# EAGLE design mikeboard (EAGLE 5.11)

## Sheet 1 of 6
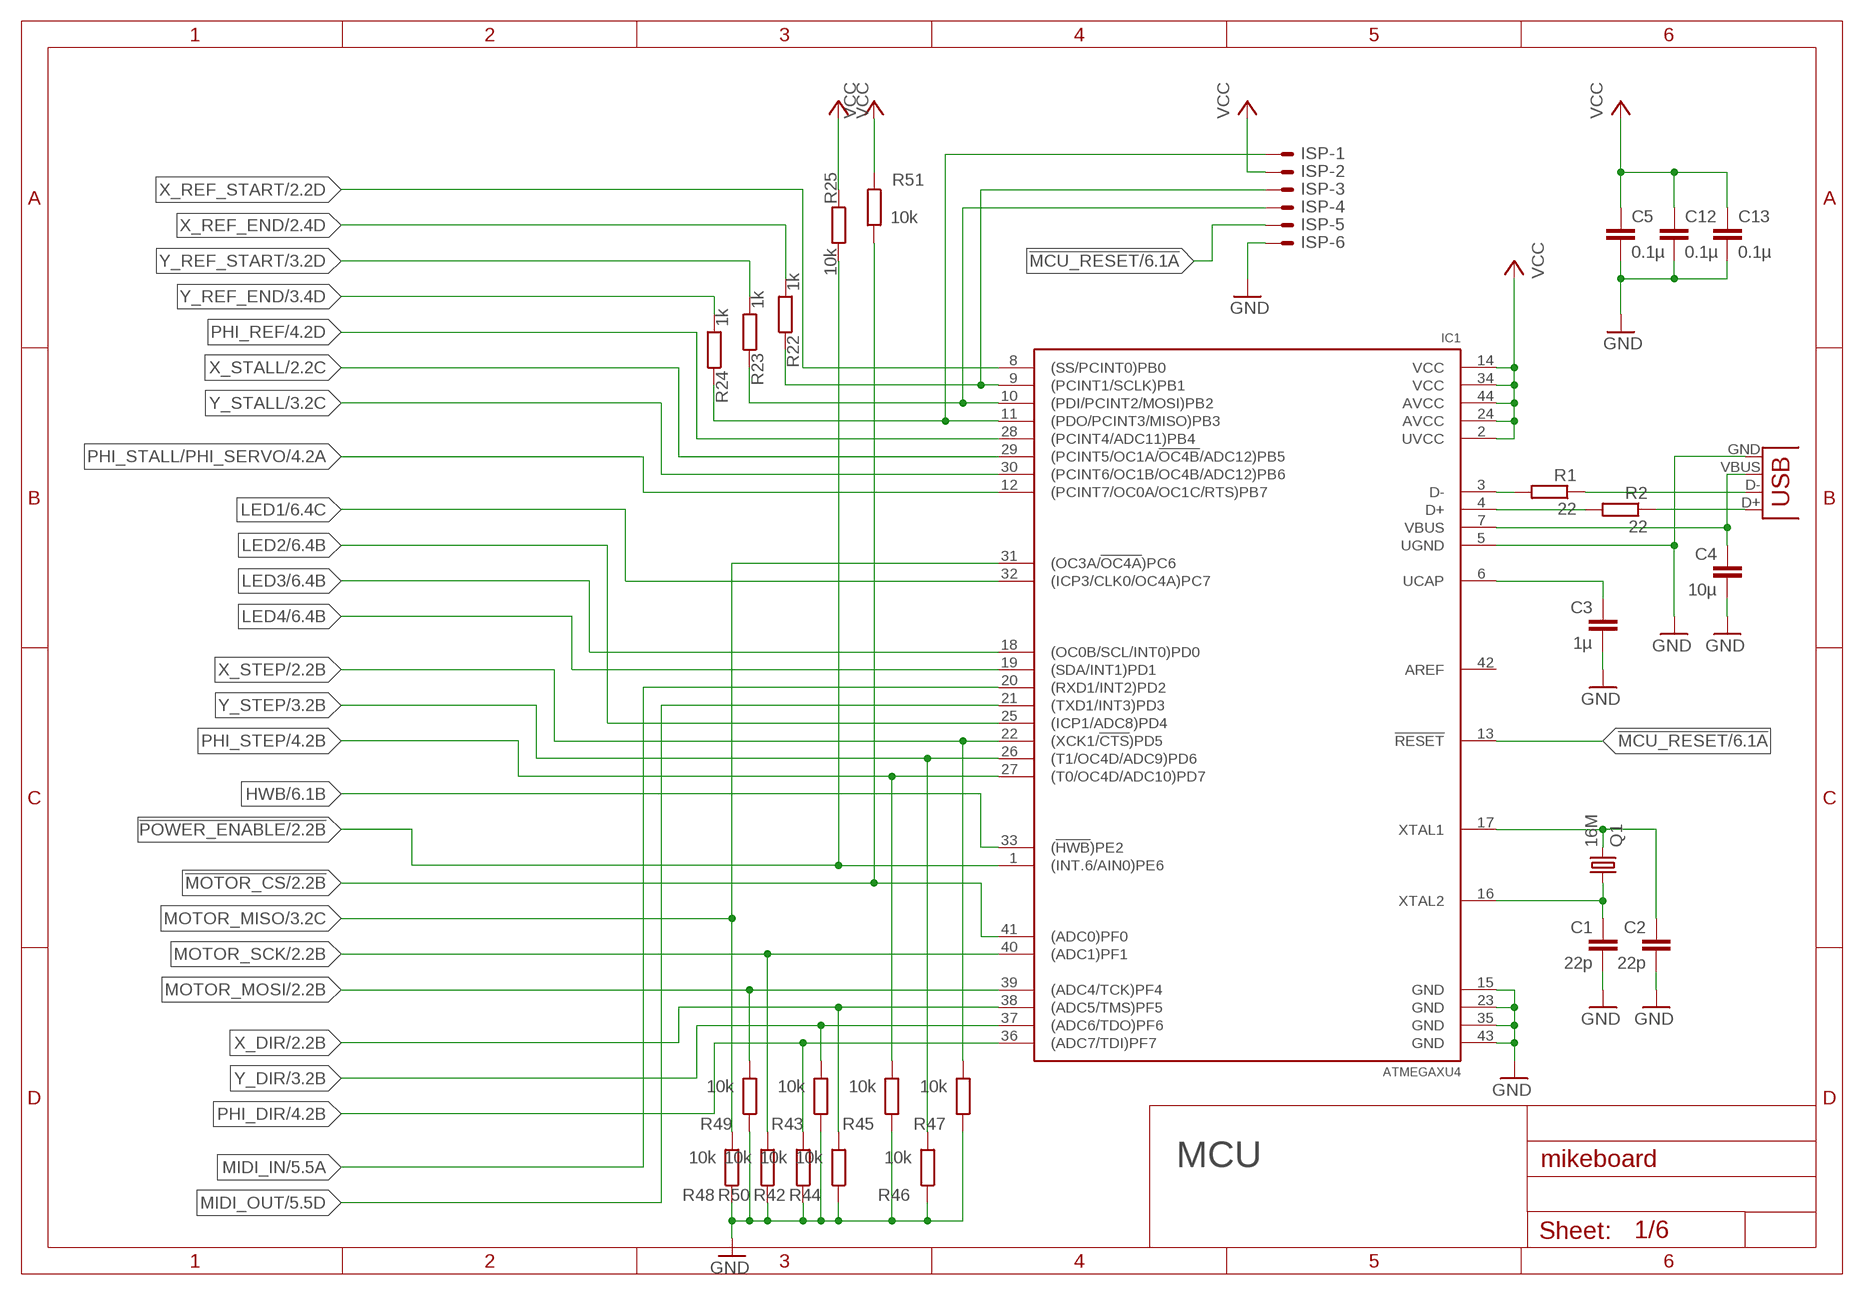
[diagram p0: schematic, sheet 1]

### Parts
C1  22p  C-EUC0603K  [C0603K]
C2  22p  C-EUC0603K  [C0603K]
C3  1µ  C-EUC0603K  [C0603K]
C4  10µ  C-EUC1206K  [C1206K]
C5  0.1µ  C-EUC0603K  [C0603K]
C12  0.1µ  C-EUC0603K  [C0603K]
C13  0.1µ  C-EUC0603K  [C0603K]
IC1  ATMEGAXU4  [TQFP44]
ISP  ML6E  [ML6]
Q1  16M  CRYSTALHC49S  [HC49/S]
R1  22  R-EU_R0603  [R0603]
R2  22  R-EU_R0603  [R0603]
R22  1k  R-EU_R0603  [R0603]
R23  1k  R-EU_R0603  [R0603]
R24  1k  R-EU_R0603  [R0603]
R25  10k  R-EU_R0603  [R0603]
R42  10k  R-EU_R0603  [R0603]
R43  10k  R-EU_R0603  [R0603]
R44  10k  R-EU_R0603  [R0603]
R45  10k  R-EU_R0603  [R0603]
R46  10k  R-EU_R0603  [R0603]
R47  10k  R-EU_R0603  [R0603]
R48  10k  R-EU_R0603  [R0603]
R49  10k  R-EU_R0603  [R0603]
R50  10k  R-EU_R0603  [R0603]
R51  10k  R-EU_R0603  [R0603]
USB  USBPTH  [USB-B-PTH]

### Nets
!MCU_RESET: IC1.13(!RESET) ISP.5 ; also sheet 6
!MOTOR_CS: IC1.41((ADC0)PF0) R51.2 ; also sheet 2,3,4
!POWER_ENABLE: IC1.1((INT.6/AIN0)PE6) R25.2 ; also sheet 2,3,4
GND: C1.2 C2.2 C3.2 C4.2 C5.2 C12.2 C13.2 IC1.5(UGND) IC1.15(GND) IC1.23(GND) IC1.35(GND) IC1.43(GND) ISP.6 R42.1 R43.1 R44.1 R45.1 R46.1 R47.1 R48.1 R49.1 R50.1 USB.GND ; also sheet 2,3,4,5,6
HWB: IC1.33((!HWB!)PE2) ; also sheet 6
ISP_MISO: IC1.11((PDO/PCINT3/MISO)PB3) ISP.1 R24.1
ISP_MOSI: IC1.10((PDI/PCINT2/MOSI)PB2) ISP.4 R23.1
ISP_SCLK: IC1.9((PCINT1/SCLK)PB1) ISP.3 R22.1
LED1: IC1.32((ICP3/CLK0/OC4A)PC7) ; also sheet 6
LED2: IC1.25((ICP1/ADC8)PD4) ; also sheet 6
LED3: IC1.18((OC0B/SCL/INT0)PD0) ; also sheet 6
LED4: IC1.19((SDA/INT1)PD1) ; also sheet 6
MIDI_IN: IC1.20((RXD1/INT2)PD2) ; also sheet 5
MIDI_OUT: IC1.21((TXD1/INT3)PD3) ; also sheet 5
MOTOR_MISO: IC1.31((OC3A/!OC4A!)PC6) R48.2 ; also sheet 3,4
MOTOR_MOSI: IC1.39((ADC4/TCK)PF4) R49.2 ; also sheet 2
MOTOR_SCK: IC1.40((ADC1)PF1) R50.2 ; also sheet 2,3,4
N$1: IC1.3(D-) R1.2
N$2: IC1.4(D+) R2.2
N$3: C1.1 IC1.16(XTAL2) Q1.1
N$4: C2.1 IC1.17(XTAL1) Q1.2
N$8: R2.1 USB.D+
N$17: R1.1 USB.D-
PHI_DIR: IC1.36((ADC7/TDI)PF7) R42.2 ; also sheet 4
PHI_REF: IC1.28((PCINT4/ADC11)PB4) ; also sheet 4
PHI_STALL/PHI_SERVO: IC1.12((PCINT7/OC0A/OC1C/RTS)PB7) ; also sheet 4
PHI_STEP: IC1.27((T0/OC4D/ADC10)PD7) R45.2 ; also sheet 4
UCAP: C3.1 IC1.6(UCAP)
VBUS: C4.1 IC1.7(VBUS) USB.VBUS
VCC: C5.1 C12.1 C13.1 IC1.2(UVCC) IC1.14(VCC) IC1.24(AVCC) IC1.34(VCC) IC1.44(AVCC) ISP.2 R25.1 R51.1 ; also sheet 2,3,4,5,6
X_DIR: IC1.38((ADC5/TMS)PF5) R44.2 ; also sheet 2
X_REF_END: R22.2 ; also sheet 2
X_REF_START: IC1.8((SS/PCINT0)PB0) ; also sheet 2
X_STALL: IC1.29((PCINT5/OC1A/!OC4B!/ADC12)PB5) ; also sheet 2
X_STEP: IC1.22((XCK1/!CTS!)PD5) R47.2 ; also sheet 2
Y_DIR: IC1.37((ADC6/TDO)PF6) R43.2 ; also sheet 3
Y_REF_END: R24.2 ; also sheet 3
Y_REF_START: R23.2 ; also sheet 3
Y_STALL: IC1.30((PCINT6/OC1B/OC4B/ADC12)PB6) ; also sheet 3
Y_STEP: IC1.26((T1/OC4D/ADC9)PD6) R46.2 ; also sheet 3
Unconnected: IC1.42(AREF)

### Notes on the sheet
- MCU

## Sheet 2 of 6
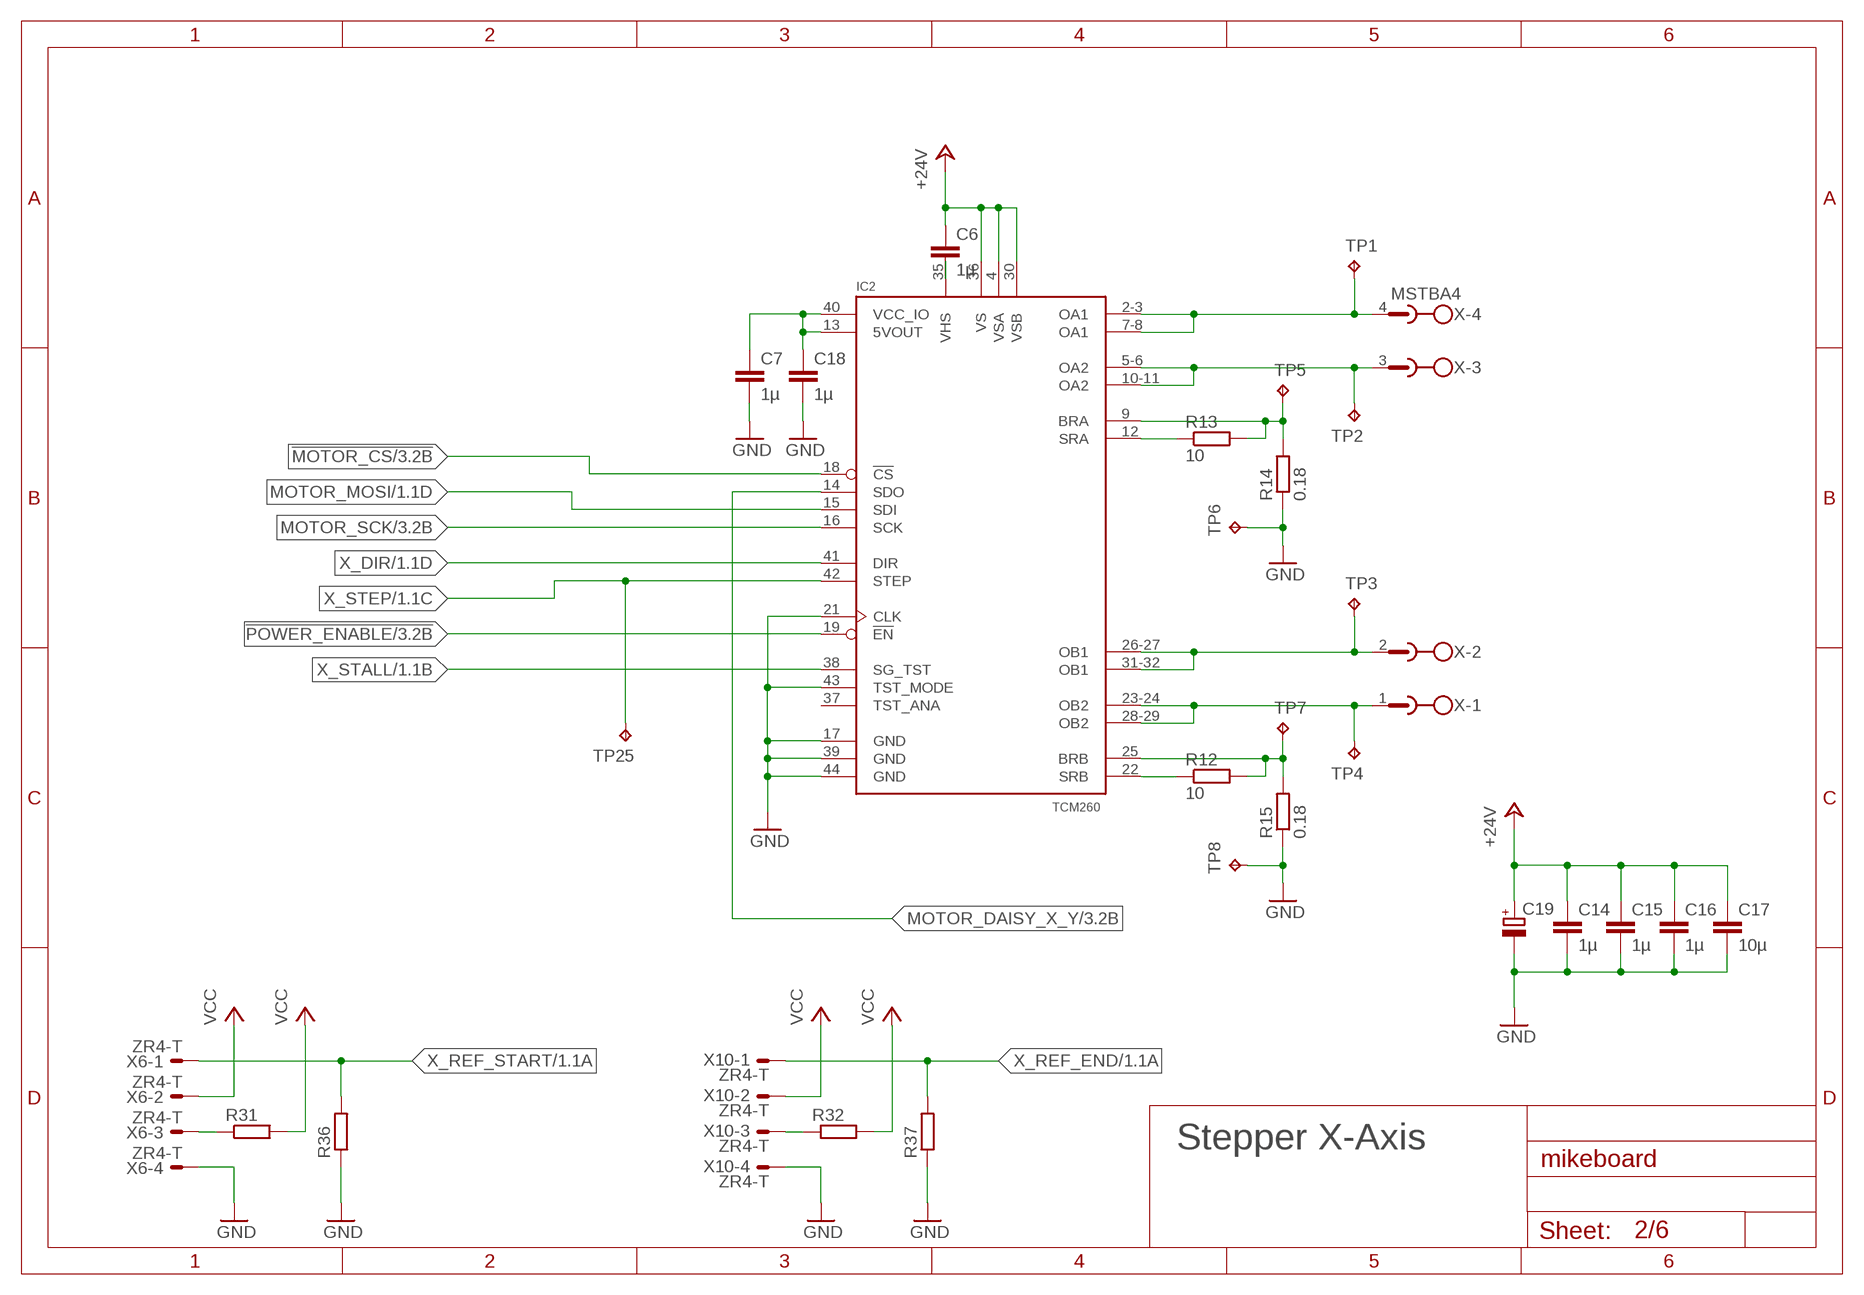
[diagram p1: schematic, sheet 2]

### Parts
C6  1µ  C-EUC0603K  [C0603K]
C7  1µ  C-EUC0603K  [C0603K]
C14  1µ  C-EUC0603K  [C0603K]
C15  1µ  C-EUC0603K  [C0603K]
C16  1µ  C-EUC0603K  [C0603K]
C17  10µ  C-EUC1206K  [C1206K]
C18  1µ  C-EUC0603K  [C0603K]
C19  CPOL-EU175TMP-0810  [175TMP-0810]
IC2  TCM260  [TRINAMIC_LQFP44]
R12  10  R-EU_R0603  [R0603]
R13  10  R-EU_R0603  [R0603]
R14  0.18  R-EU_R2512  [R2512]
R15  0.18  R-EU_R2512  [R2512]
R31  R-EU_R0603  [R0603]
R32  R-EU_R0603  [R0603]
R36  R-EU_R0603  [R0603]
R37  R-EU_R0603  [R0603]
TP1  TPPAD1-13  [P1-13]
TP2  TPPAD1-13  [P1-13]
TP3  TPPAD1-13  [P1-13]
TP4  TPPAD1-13  [P1-13]
TP5  TPPAD1-13  [P1-13]
TP6  TPPAD1-13  [P1-13]
TP7  TPPAD1-13  [P1-13]
TP8  TPPAD1-13  [P1-13]
TP25  TPPAD1-13  [P1-13]
X  MSTBA4  [MSTBA4]
X6  ZR4-T  [ZR-04T]
X10  ZR4-T  [ZR-04T]

### Nets
5VOUT_X: C7.1 C18.1 IC2.13(5VOUT) IC2.40(VCC_IO)
!MOTOR_CS: IC2.18(!CS) ; also sheet 1,3,4
!POWER_ENABLE: IC2.19(!EN) ; also sheet 1,3,4
+24V: C6.1 C14.1 C15.1 C16.1 C17.1 C19.+ IC2.4(VSA) IC2.30(VSB) IC2.36(VS) ; also sheet 3,4,6
A1_X: IC2.2-3(OA1) IC2.7-8(OA1) TP1.TP X.4
A2_X: IC2.5-6(OA2) IC2.10-11(OA2) TP2.TP X.3
B1_X: IC2.26-27(OB1) IC2.31-32(OB1) TP3.TP X.2
B2_X: IC2.23-24(OB2) IC2.28-29(OB2) TP4.TP X.1
BRA_X: IC2.9(BRA) R13.2 R14.2 TP5.TP
BRB_X: IC2.25(BRB) R12.2 R15.2 TP7.TP
GND: C7.2 C14.2 C15.2 C16.2 C17.2 C18.2 C19.- IC2.17(GND) IC2.21(CLK) IC2.39(GND) IC2.43(TST_MODE) IC2.44(GND) R14.1 R15.1 R36.1 R37.1 TP6.TP TP8.TP X6.4 X10.4 ; also sheet 1,3,4,5,6
MOTOR_DAISY_X_Y: IC2.14(SDO) ; also sheet 3
MOTOR_MOSI: IC2.15(SDI) ; also sheet 1
MOTOR_SCK: IC2.16(SCK) ; also sheet 1,3,4
N$20: R31.1 X6.3
N$23: R32.1 X10.3
N$27: C6.2 IC2.35(VHS)
N$34: IC2.12(SRA) R13.1
N$36: IC2.22(SRB) R12.1
VCC: R31.2 R32.2 X6.2 X10.2 ; also sheet 1,3,4,5,6
X_DIR: IC2.41(DIR) ; also sheet 1
X_REF_END: R37.2 X10.1 ; also sheet 1
X_REF_START: R36.2 X6.1 ; also sheet 1
X_STALL: IC2.38(SG_TST) ; also sheet 1
X_STEP: IC2.42(STEP) TP25.TP ; also sheet 1
Unconnected: IC2.1(NC) IC2.20(NC) IC2.33(NC) IC2.34(NC) IC2.37(TST_ANA)

### Notes on the sheet
- Stepper X-Axis

## Sheet 3 of 6
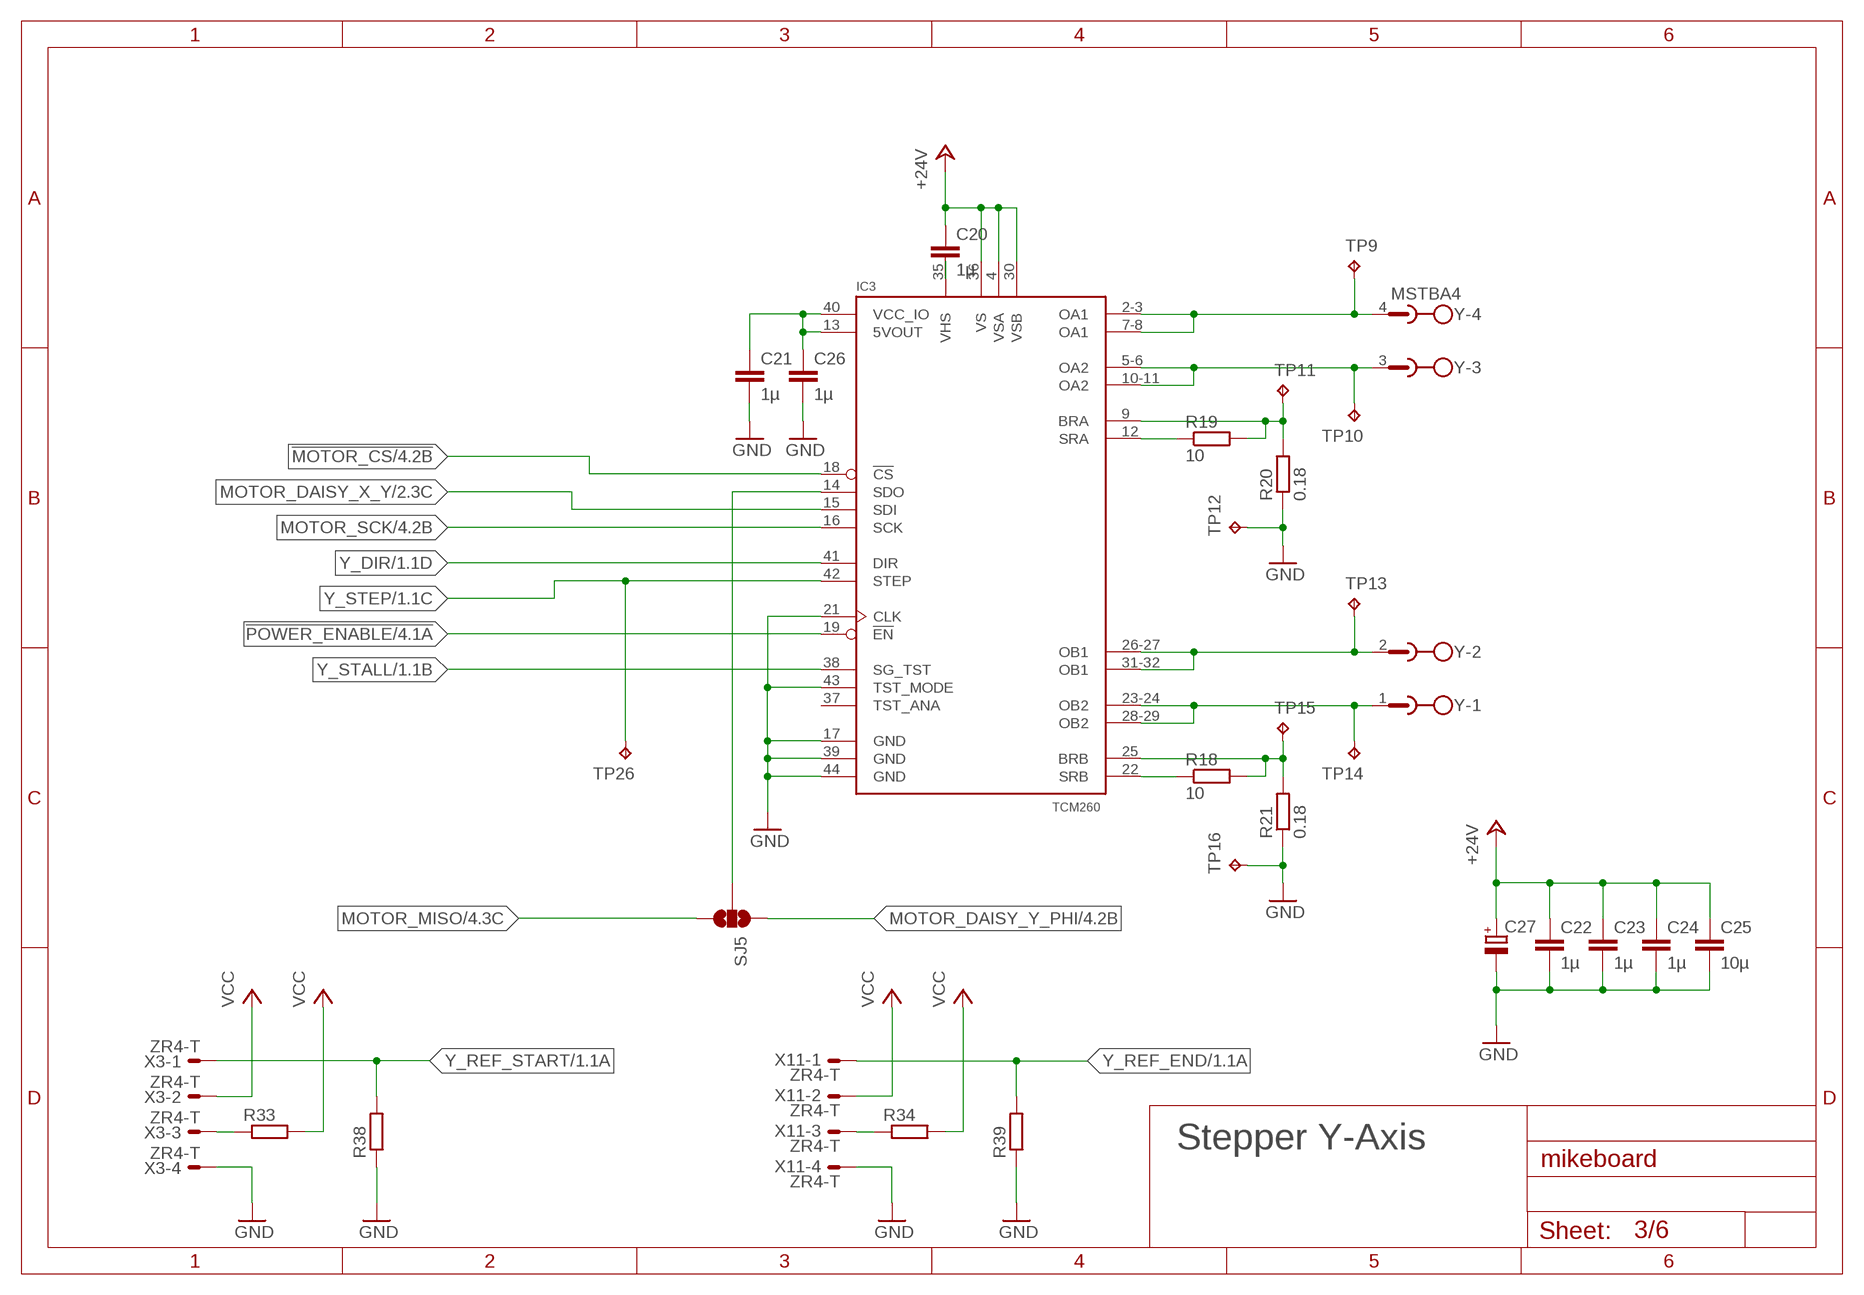
[diagram p2: schematic, sheet 3]

### Parts
C20  1µ  C-EUC0603K  [C0603K]
C21  1µ  C-EUC0603K  [C0603K]
C22  1µ  C-EUC0603K  [C0603K]
C23  1µ  C-EUC0603K  [C0603K]
C24  1µ  C-EUC0603K  [C0603K]
C25  10µ  C-EUC1206K  [C1206K]
C26  1µ  C-EUC0603K  [C0603K]
C27  CPOL-EU175TMP-0810  [175TMP-0810]
IC3  TCM260  [TRINAMIC_LQFP44]
R18  10  R-EU_R0603  [R0603]
R19  10  R-EU_R0603  [R0603]
R20  0.18  R-EU_R2512  [R2512]
R21  0.18  R-EU_R2512  [R2512]
R33  R-EU_R0603  [R0603]
R34  R-EU_R0603  [R0603]
R38  R-EU_R0603  [R0603]
R39  R-EU_R0603  [R0603]
SJ5  SOLDERJUMPER_2WAYPASTE1&2  [SJ_3_PASTE1&2]
TP9  TPPAD1-13  [P1-13]
TP10  TPPAD1-13  [P1-13]
TP11  TPPAD1-13  [P1-13]
TP12  TPPAD1-13  [P1-13]
TP13  TPPAD1-13  [P1-13]
TP14  TPPAD1-13  [P1-13]
TP15  TPPAD1-13  [P1-13]
TP16  TPPAD1-13  [P1-13]
TP26  TPPAD1-13  [P1-13]
X3  ZR4-T  [ZR-04T]
X11  ZR4-T  [ZR-04T]
Y  MSTBA4  [MSTBA4]

### Nets
5VOUT_Y: C21.1 C26.1 IC3.13(5VOUT) IC3.40(VCC_IO)
!MOTOR_CS: IC3.18(!CS) ; also sheet 1,2,4
!POWER_ENABLE: IC3.19(!EN) ; also sheet 1,2,4
+24V: C20.1 C22.1 C23.1 C24.1 C25.1 C27.+ IC3.4(VSA) IC3.30(VSB) IC3.36(VS) ; also sheet 2,4,6
A1_Y: IC3.2-3(OA1) IC3.7-8(OA1) TP9.TP Y.4
A2_Y: IC3.5-6(OA2) IC3.10-11(OA2) TP10.TP Y.3
B1_Y: IC3.26-27(OB1) IC3.31-32(OB1) TP13.TP Y.2
B2_Y: IC3.23-24(OB2) IC3.28-29(OB2) TP14.TP Y.1
GND: C21.2 C22.2 C23.2 C24.2 C25.2 C26.2 C27.- IC3.17(GND) IC3.21(CLK) IC3.39(GND) IC3.43(TST_MODE) IC3.44(GND) R20.1 R21.1 R38.1 R39.1 TP12.TP TP16.TP X3.4 X11.4 ; also sheet 1,2,4,5,6
MOTOR_DAISY_X_Y: IC3.15(SDI) ; also sheet 2
MOTOR_DAISY_Y_PHI: SJ5.1 ; also sheet 4
MOTOR_MISO: SJ5.3 ; also sheet 1,4
MOTOR_SCK: IC3.16(SCK) ; also sheet 1,2,4
N$24: R33.1 X3.3
N$25: R34.1 X11.3
N$43: IC3.12(SRA) R19.1
N$44: IC3.9(BRA) R19.2 R20.2 TP11.TP
N$45: IC3.22(SRB) R18.1
N$46: IC3.25(BRB) R18.2 R21.2 TP15.TP
N$47: C20.2 IC3.35(VHS)
SDO_Y: IC3.14(SDO) SJ5.2
VCC: R33.2 R34.2 X3.2 X11.2 ; also sheet 1,2,4,5,6
Y_DIR: IC3.41(DIR) ; also sheet 1
Y_REF_END: R39.2 X11.1 ; also sheet 1
Y_REF_START: R38.2 X3.1 ; also sheet 1
Y_STALL: IC3.38(SG_TST) ; also sheet 1
Y_STEP: IC3.42(STEP) TP26.TP ; also sheet 1
Unconnected: IC3.1(NC) IC3.20(NC) IC3.33(NC) IC3.34(NC) IC3.37(TST_ANA)

### Notes on the sheet
- Stepper Y-Axis

## Sheet 4 of 6
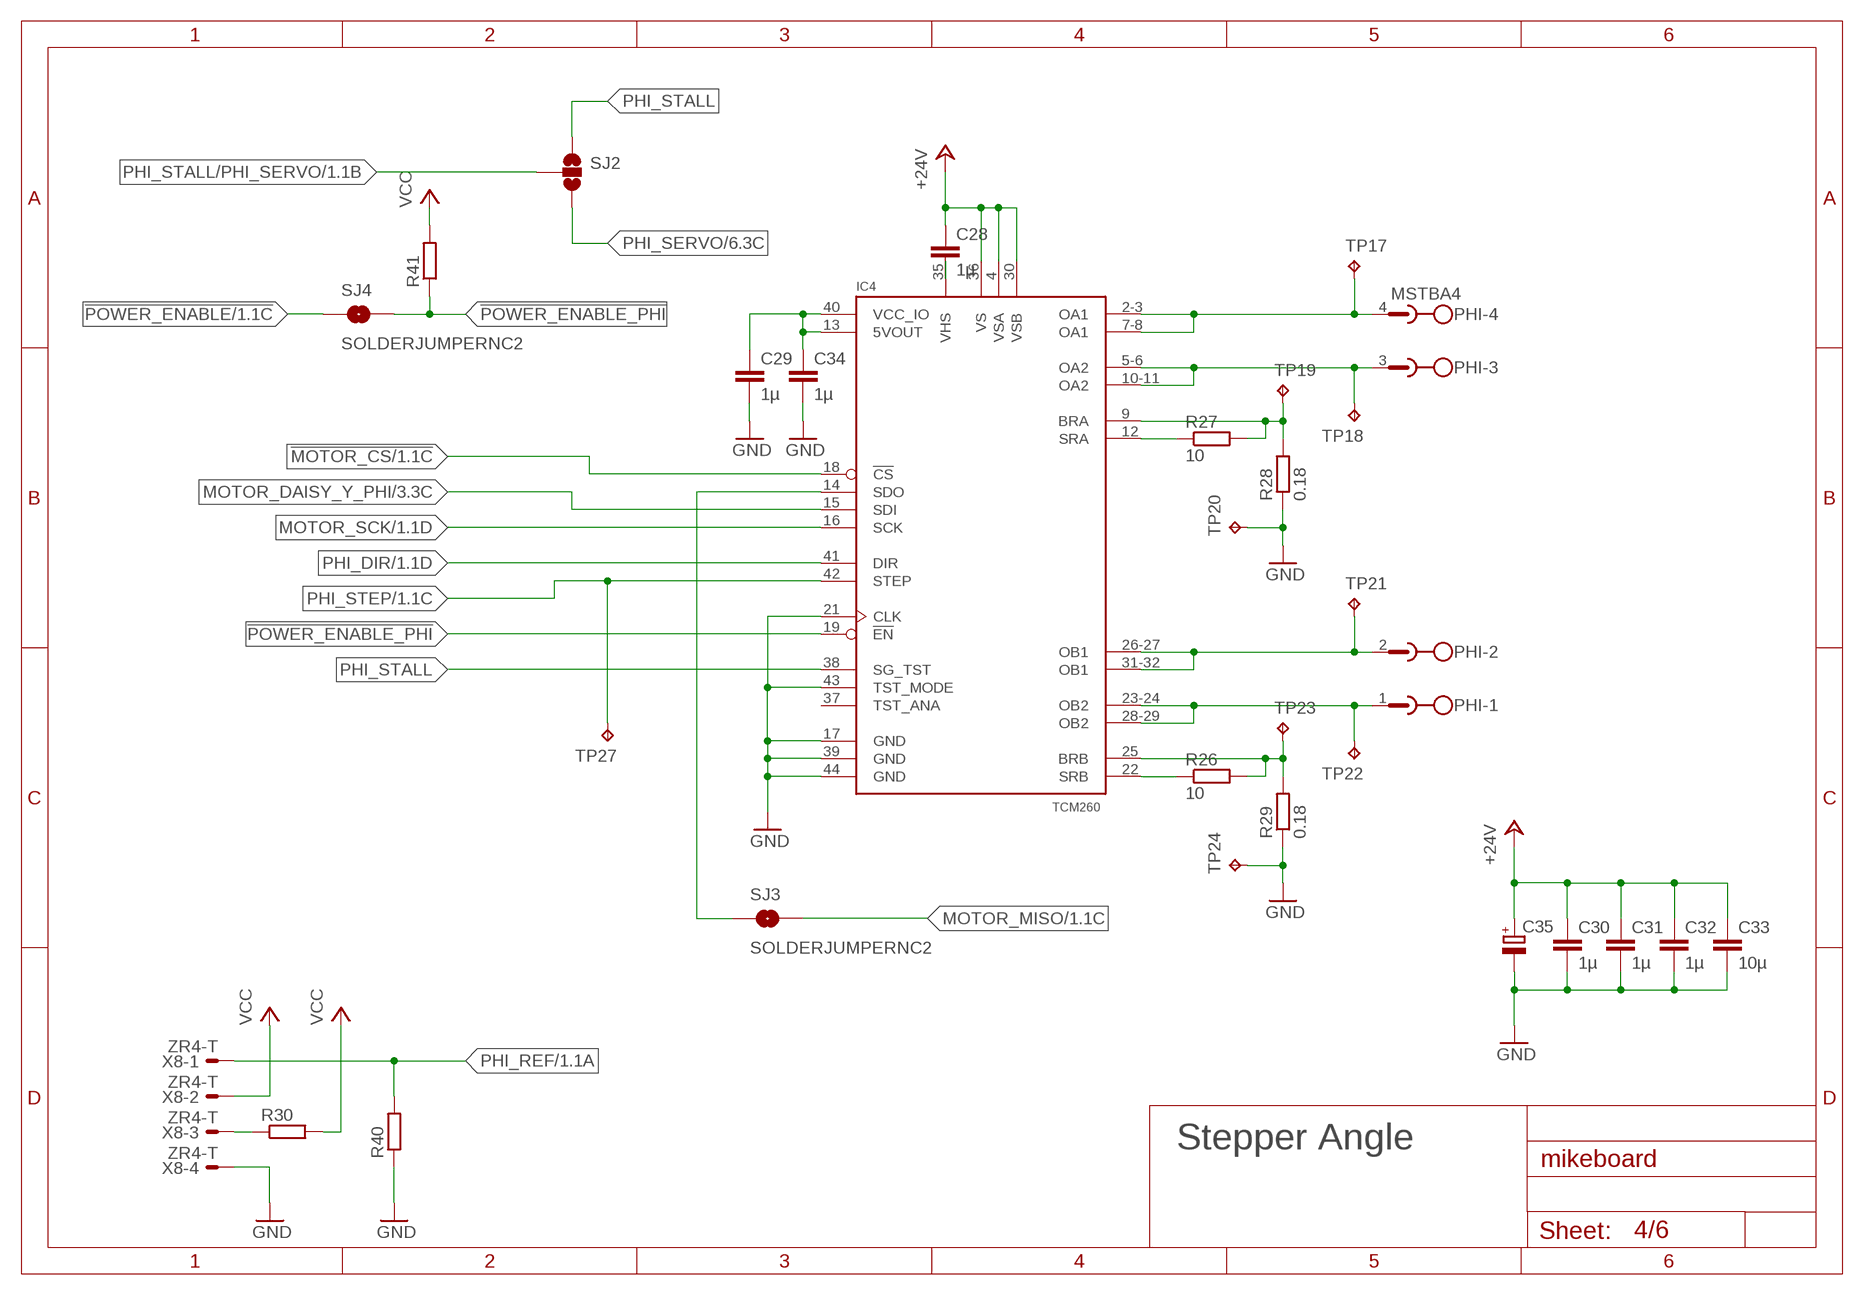
[diagram p3: schematic, sheet 4]

### Parts
C28  1µ  C-EUC0603K  [C0603K]
C29  1µ  C-EUC0603K  [C0603K]
C30  1µ  C-EUC0603K  [C0603K]
C31  1µ  C-EUC0603K  [C0603K]
C32  1µ  C-EUC0603K  [C0603K]
C33  10µ  C-EUC1206K  [C1206K]
C34  1µ  C-EUC0603K  [C0603K]
C35  CPOL-EU175TMP-0810  [175TMP-0810]
IC4  TCM260  [TRINAMIC_LQFP44]
PHI  MSTBA4  [MSTBA4]
R26  10  R-EU_R0603  [R0603]
R27  10  R-EU_R0603  [R0603]
R28  0.18  R-EU_R2512  [R2512]
R29  0.18  R-EU_R2512  [R2512]
R30  R-EU_R0603  [R0603]
R40  R-EU_R0603  [R0603]
R41  R-EU_R0603  [R0603]
SJ2  SOLDERJUMPER_2WAYPASTE1&2  [SJ_3_PASTE1&2]
SJ3  SOLDERJUMPERNC2  [SJ_2S-NOTRACE]
SJ4  SOLDERJUMPERNC2  [SJ_2S-NOTRACE]
TP17  TPPAD1-13  [P1-13]
TP18  TPPAD1-13  [P1-13]
TP19  TPPAD1-13  [P1-13]
TP20  TPPAD1-13  [P1-13]
TP21  TPPAD1-13  [P1-13]
TP22  TPPAD1-13  [P1-13]
TP23  TPPAD1-13  [P1-13]
TP24  TPPAD1-13  [P1-13]
TP27  TPPAD1-13  [P1-13]
X8  ZR4-T  [ZR-04T]

### Nets
5VOUT_PHI: C29.1 C34.1 IC4.13(5VOUT) IC4.40(VCC_IO)
!MOTOR_CS: IC4.18(!CS) ; also sheet 1,2,3
!POWER_ENABLE: SJ4.1 ; also sheet 1,2,3
!POWER_ENABLE_PHI: IC4.19(!EN) R41.1 SJ4.2
+24V: C28.1 C30.1 C31.1 C32.1 C33.1 C35.+ IC4.4(VSA) IC4.30(VSB) IC4.36(VS) ; also sheet 2,3,6
A1_PHI: IC4.2-3(OA1) IC4.7-8(OA1) PHI.4 TP17.TP
A2_PHI: IC4.5-6(OA2) IC4.10-11(OA2) PHI.3 TP18.TP
B1_PHI: IC4.26-27(OB1) IC4.31-32(OB1) PHI.2 TP21.TP
B2_PHI: IC4.23-24(OB2) IC4.28-29(OB2) PHI.1 TP22.TP
GND: C29.2 C30.2 C31.2 C32.2 C33.2 C34.2 C35.- IC4.17(GND) IC4.21(CLK) IC4.39(GND) IC4.43(TST_MODE) IC4.44(GND) R28.1 R29.1 R40.1 TP20.TP TP24.TP X8.4 ; also sheet 1,2,3,5,6
MOTOR_DAISY_Y_PHI: IC4.15(SDI) ; also sheet 3
MOTOR_MISO: SJ3.2 ; also sheet 1,3
MOTOR_SCK: IC4.16(SCK) ; also sheet 1,2,3
N$19: R30.1 X8.3
N$38: IC4.12(SRA) R27.1
N$39: IC4.9(BRA) R27.2 R28.2 TP19.TP
N$48: IC4.22(SRB) R26.1
N$49: IC4.25(BRB) R26.2 R29.2 TP23.TP
N$50: C28.2 IC4.35(VHS)
PHI_DIR: IC4.41(DIR) ; also sheet 1
PHI_REF: R40.2 X8.1 ; also sheet 1
PHI_SERVO: SJ2.3 ; also sheet 6
PHI_STALL: IC4.38(SG_TST) SJ2.1
PHI_STALL/PHI_SERVO: SJ2.2 ; also sheet 1
PHI_STEP: IC4.42(STEP) TP27.TP ; also sheet 1
SDO_PHI: IC4.14(SDO) SJ3.1
VCC: R30.2 R41.2 X8.2 ; also sheet 1,2,3,5,6
Unconnected: IC4.1(NC) IC4.20(NC) IC4.33(NC) IC4.34(NC) IC4.37(TST_ANA)

### Notes on the sheet
- Stepper Angle

## Sheet 5 of 6
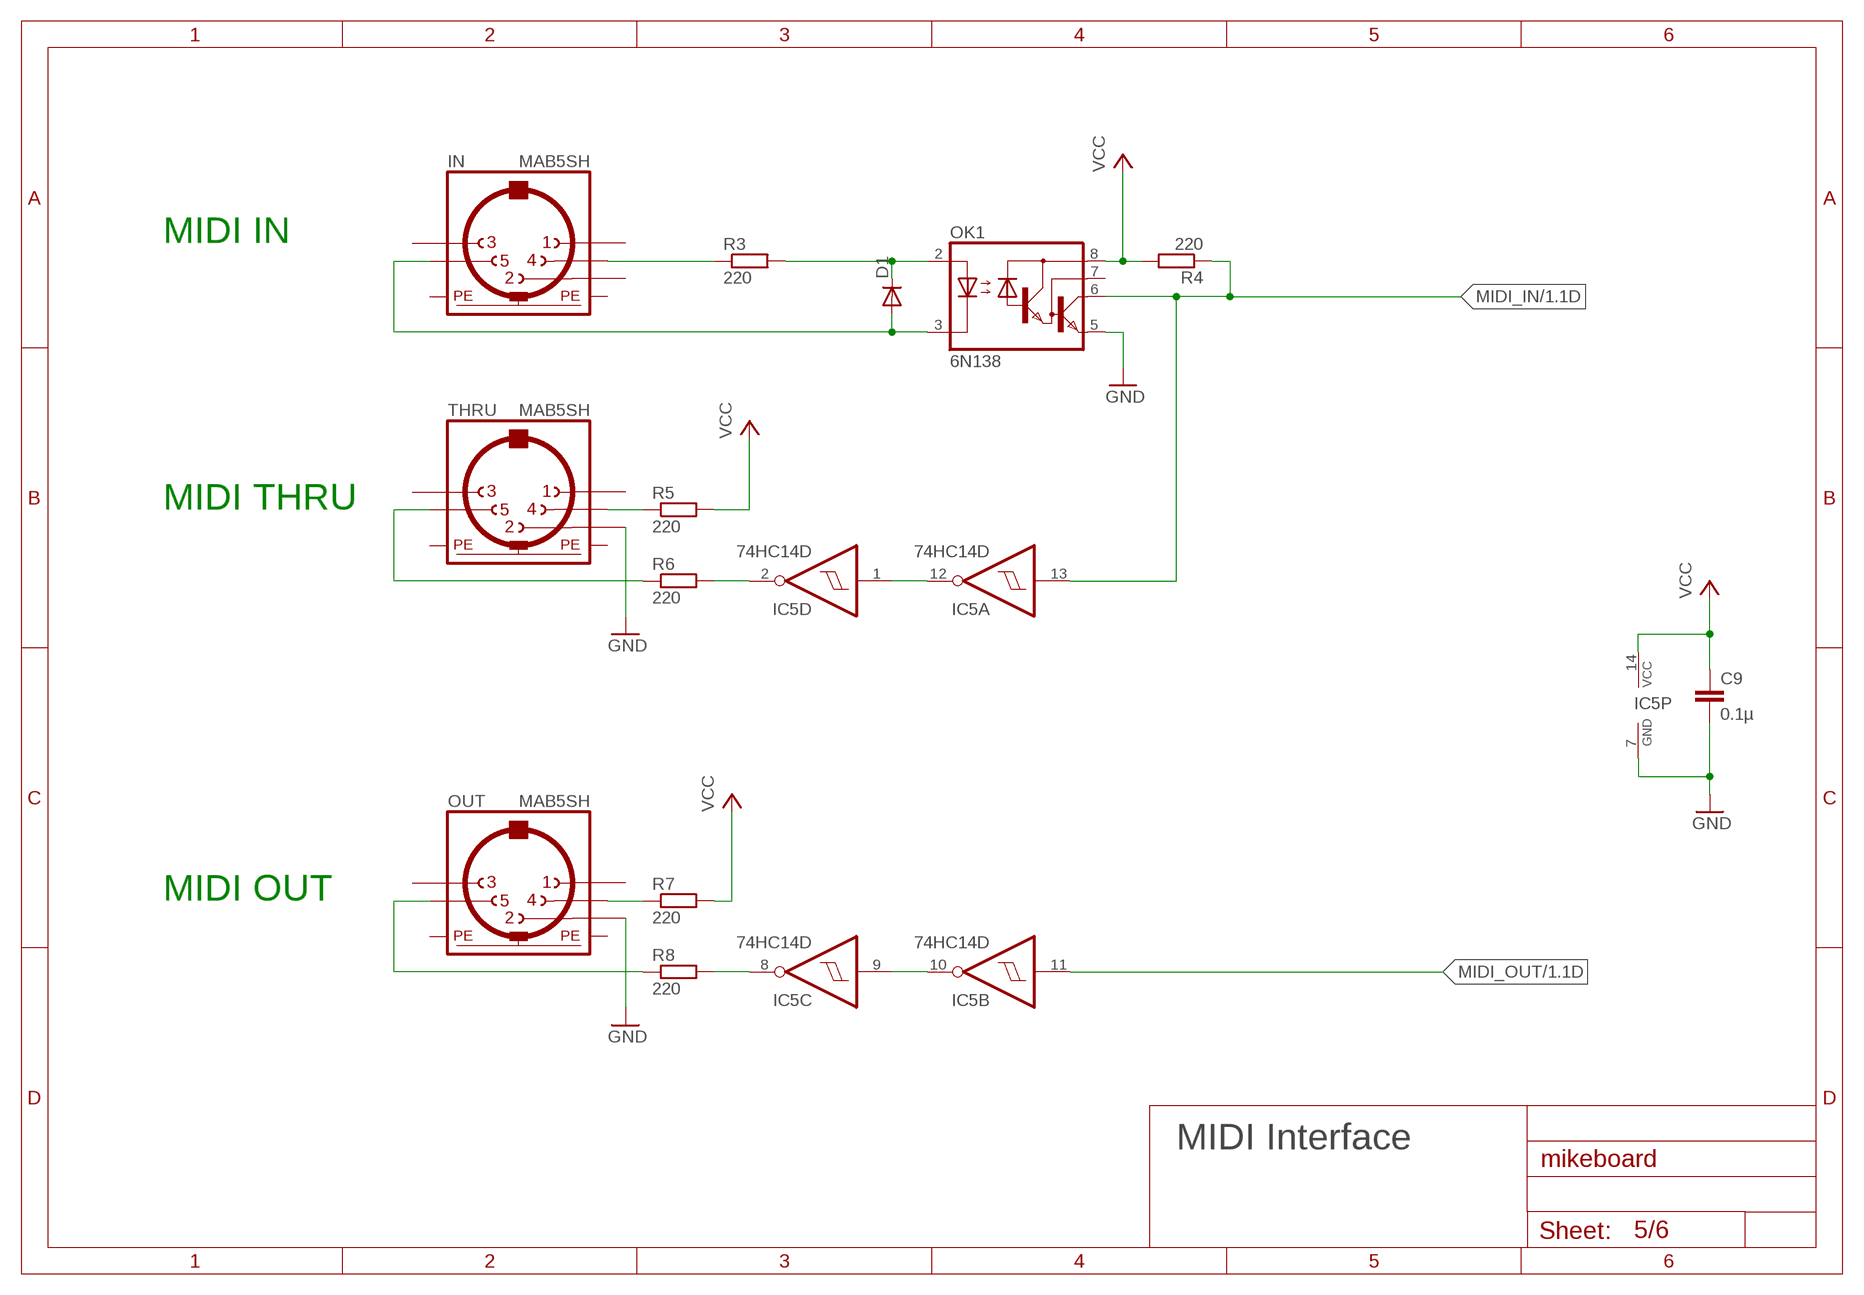
[diagram p4: schematic, sheet 5]

### Parts
C9  0.1µ  C-EUC0603K  [C0603K]
D1  DIODE-MICROMELF-W  [MICROMELF-W]
IC5  74HC14D  [SO14]
IN  MAB5SH  [MAB5SH]
OK1  6N138  [DIL08]
OUT  MAB5SH  [MAB5SH]
R3  220  R-EU_R0603  [R0603]
R4  220  R-EU_R0603  [R0603]
R5  220  R-EU_R0603  [R0603]
R6  220  R-EU_R0603  [R0603]
R7  220  R-EU_R0603  [R0603]
R8  220  R-EU_R0603  [R0603]
THRU  MAB5SH  [MAB5SH]

### Nets
GND: C9.2 IC5.7(P:GND) OK1.5(GND) OUT.2 THRU.2 ; also sheet 1,2,3,4,6
MIDI_IN: IC5.13(A:I) OK1.6(VO) R4.1 ; also sheet 1
MIDI_OUT: IC5.11(B:I) ; also sheet 1
N$5: IN.4 R3.1
N$6: D1.C OK1.2(A) R3.2
N$7: D1.A IN.5 OK1.3(C)
N$9: IC5.1(D:I) IC5.12(A:O)
N$10: IC5.2(D:O) R6.2
N$11: R6.1 THRU.5
N$12: R5.1 THRU.4
N$13: IC5.9(C:I) IC5.10(B:O)
N$14: IC5.8(C:O) R8.2
N$15: OUT.5 R8.1
N$16: OUT.4 R7.1
VCC: C9.1 IC5.14(P:VCC) OK1.8(VCC) R4.2 R5.2 R7.2 ; also sheet 1,2,3,4,6
Unconnected: IN.1 IN.2 IN.3 OK1.7(VB) OUT.1 OUT.3 THRU.1 THRU.3

### Notes on the sheet
- MIDI IN
- MIDI THRU
- MIDI OUT
- MIDI Interface

## Sheet 6 of 6
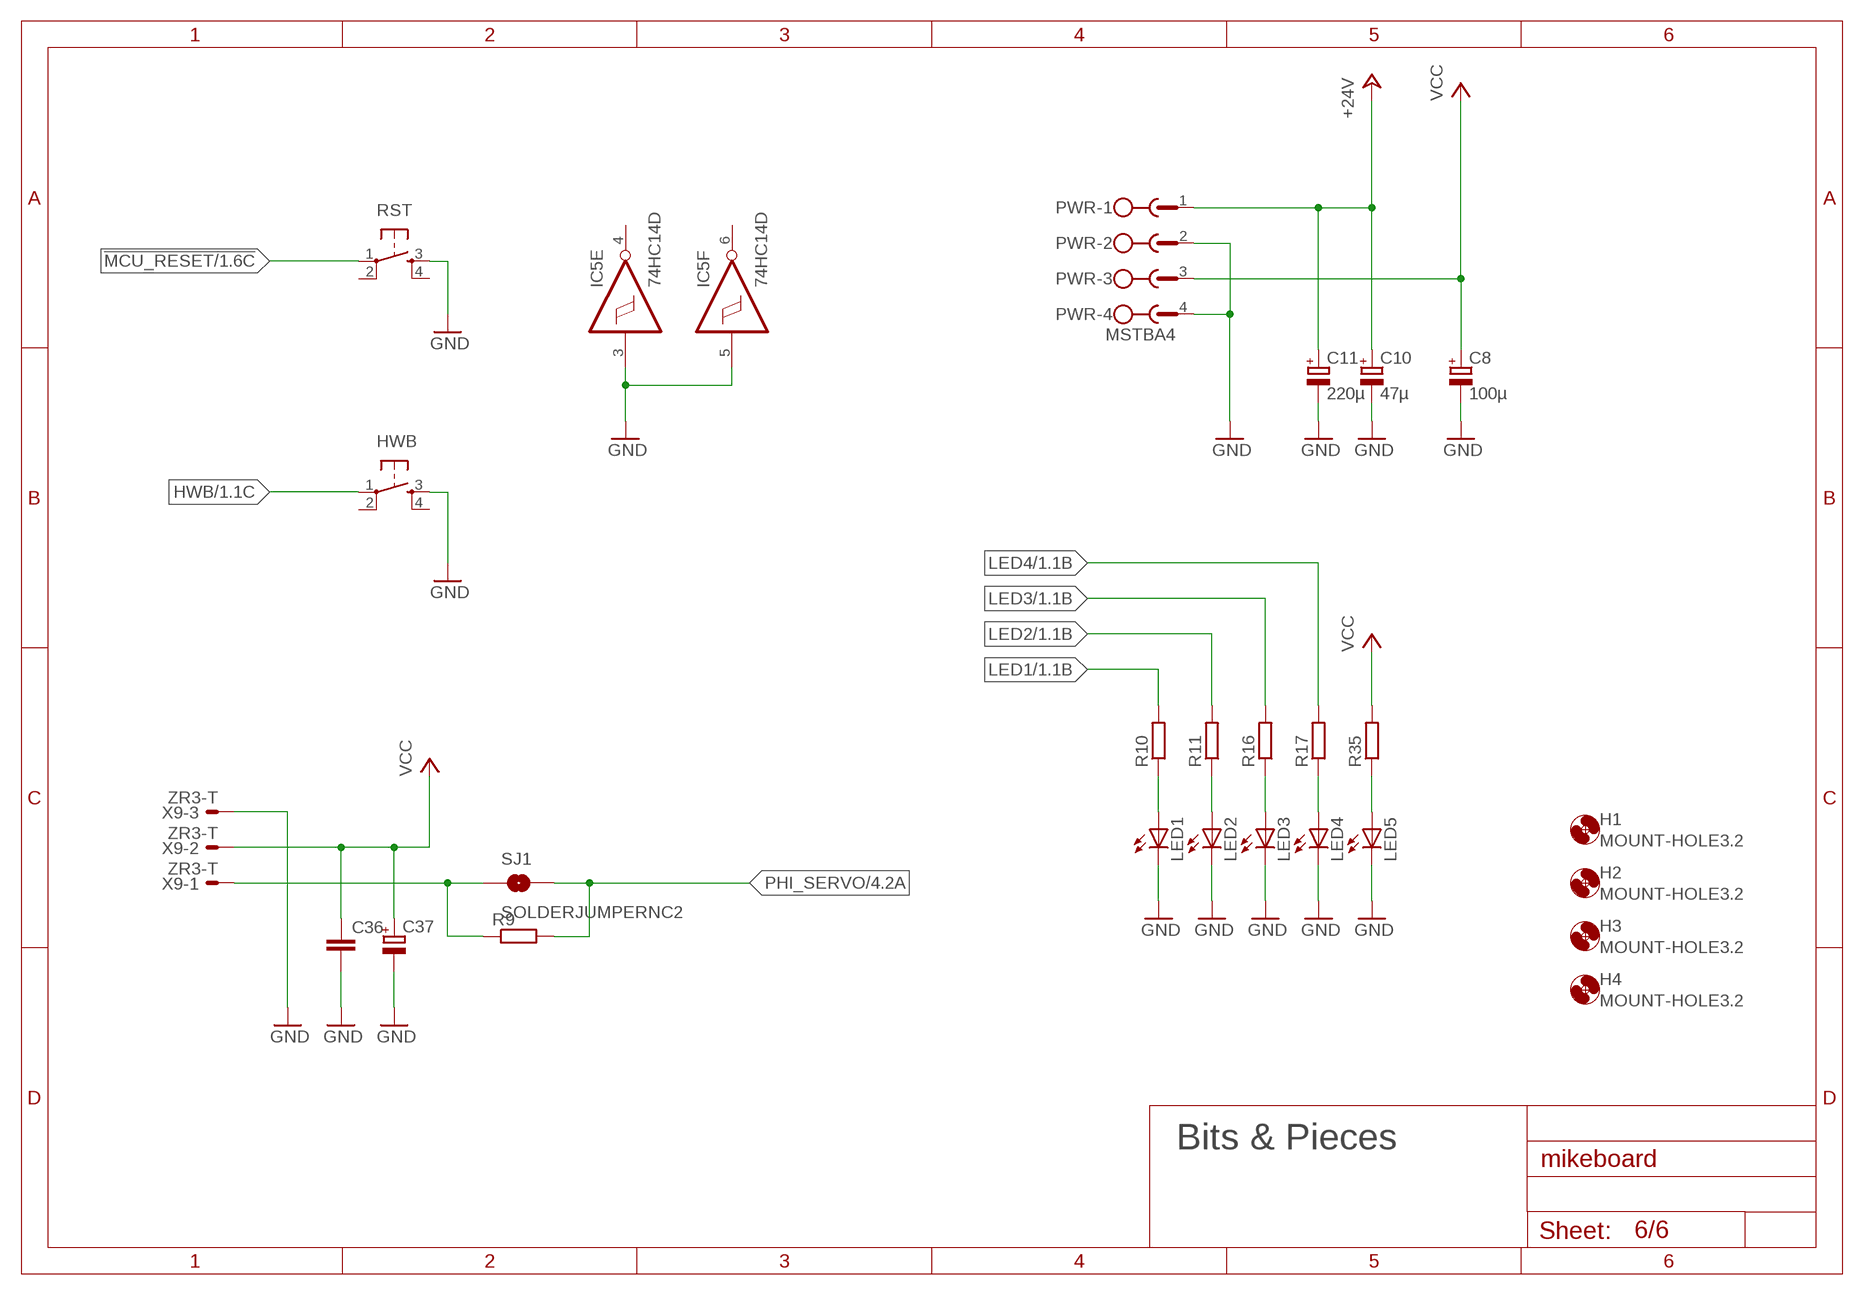
[diagram p5: schematic, sheet 6]

### Parts
C8  100µ  CPOL-EU153CLV-0807  [153CLV-0807]
C10  47µ  CPOL-EU153CLV-1010  [153CLV-1010]
C11  220µ  CPOL-EU153CLV-1010  [153CLV-1010]
C36  C-EU025-024X044  [C025-024X044]
C37  CPOL-EUE2,5-6E  [E2,5-6E]
H1  MOUNT-HOLE3.2  [3,2]
H2  MOUNT-HOLE3.2  [3,2]
H3  MOUNT-HOLE3.2  [3,2]
H4  MOUNT-HOLE3.2  [3,2]
HWB  TAC_SWITCHPTH  [TACTILE-PTH]
LED1  LED3MM  [LED_WITH_HOLDER_90_3MM]
LED2  LED3MM  [LED_WITH_HOLDER_90_3MM]
LED3  LED3MM  [LED_WITH_HOLDER_90_3MM]
LED4  LED3MM  [LED_WITH_HOLDER_90_3MM]
LED5  LED3MM  [LED_WITH_HOLDER_90_3MM]
PWR  MSTBA4  [MSTBA4]
R9  R-EU_R0603  [R0603]
R10  R-EU_R0603  [R0603]
R11  R-EU_R0603  [R0603]
R16  R-EU_R0603  [R0603]
R17  R-EU_R0603  [R0603]
R35  R-EU_R0603  [R0603]
RST  TAC_SWITCHPTH  [TACTILE-PTH]
SJ1  SOLDERJUMPERNC2  [SJ_2S-NOTRACE]
X9  ZR3-T  [ZR-03T]

### Nets
!MCU_RESET: RST.1 ; also sheet 1
+24V: C10.+ C11.+ PWR.1 ; also sheet 2,3,4
GND: C8.- C10.- C11.- C36.2 C37.- HWB.3 IC5.3(E:I) IC5.5(F:I) LED1.K(C) LED2.K(C) LED3.K(C) LED4.K(C) LED5.K(C) PWR.2 PWR.4 RST.3 X9.3 ; also sheet 1,2,3,4,5
HWB: HWB.1 ; also sheet 1
LED1: R10.2 ; also sheet 1
LED2: R11.2 ; also sheet 1
LED3: R16.2 ; also sheet 1
LED4: R17.2 ; also sheet 1
N$18: R9.1 SJ1.1 X9.1
N$26: LED5.A R35.1
N$28: LED1.A R10.1
N$29: LED2.A R11.1
N$32: LED3.A R16.1
N$33: LED4.A R17.1
PHI_SERVO: R9.2 SJ1.2 ; also sheet 4
VCC: C8.+ C36.1 C37.+ PWR.3 R35.2 X9.2 ; also sheet 1,2,3,4,5
Unconnected: HWB.2 HWB.4 IC5.4(E:O) IC5.6(F:O) RST.2 RST.4

### Notes on the sheet
- Bits & Pieces

## Power pins joined to a net without a drawn wire
PE: IN.PE IN.PE@(PE) OUT.PE OUT.PE@(PE) THRU.PE THRU.PE@(PE)

## Library data of the parts
C1-C7 C9 C12-C18 C20-C26 C28-C34 C36 = rcl:C-EU: CAPACITOR, European symbol
C8 C10 C11 C19 C27 C35 C37 = rcl:CPOL-EU: POLARIZED CAPACITOR, European symbol
D1 = my_parts:DIODE-: DIODE
H1-H4 = holes:MOUNT-HOLE: MOUNTING HOLE with drill center marker
HWB RST = SparkFun:TAC_SWITCH: Momentary Switch Button commonly used for reset or general input. Spark Fun Electronics SKU : COM-00097
IC1 = my_parts:ATMEGAXU4
IC2-IC4 = my_parts:TCM260
IC5 = 74xx-eu:74*14: Hex schmitt trigger INVERTER
IN OUT THRU = my_parts:MAB5SH: Female CONNECTOR 5 pins 90 deg. with shield, horizontal (DIN 41524); OC_FARNELL: 809883; OC_NEWARK: unknown
ISP = my_parts:ML6?E: HARTING; OC_FARNELL: unknown; OC_NEWARK: unknown
LED1-LED5 = my_parts:LED: LED OSRAM: - CHIPLED LG R971, LG N971, LY N971, LG Q971, LY Q971, LO R971, LY R971 LH N974, LH R974 LS Q976, LO Q976, LY Q976 LO Q996 - Hyper CHIPLED LW Q18S LB Q993, LB Q99A, LB R99A - SideLED LS A670, LO A670, LY A670, LG A670, LP A670 LB A673, LV A673, LT A673, LW A673 LH A674 LY A675 LS A676, LA A676, LO A676, LY A676, LW A676 LS A679, LY A679, LG A679 - Hyper Micro SIDELED® LS Y876, LA Y876, LO Y876, LY Y876 LT Y87S - SmartLED LW L88C, LW L88S LB L89C, LB L89S, LG L890 LS L89K, LO L89K, LY L89K LS L896, LA L896, LO L896, LY L896 - TOPLED LS T670, LO T670, LY T670, LG T670, LP T670 LSG T670, LSP T670, LSY T670, LOP T670, LYG T670 LG T671, LOG T671, LSG T671 LB T673, LV T673, LT T673, LW T673 LH T674 LS T676, LA T676, LO T676, LY T676, LB T676, LH T676, LSB T676, LW T676 LB T67C, LV T67C, LT T67C, LS T67K, LO T67K, LY T67K, LW E67C LS E67B, LA E67B, LO E67B, LY E67B, LB E67C, LV E67C, LT E67C LW T67C LS T679, LY T679, LG T679 LS T770, LO T770, LY T770, LG T770, LP T770 LB T773, LV T773, LT T773, LW T773 LH T774 LS E675, LA E675, LY E675, LS T675 LS T776, LA T776, LO T776, LY T776, LB T776 LHGB T686 LT T68C, LB T68C - Hyper Mini TOPLED® LB M676 - Mini TOPLED Santana® LG M470 LS M47K, LO M47K, LY M47K Source: http://www.osram.convergy.de LUXEON: - LUMILED® LXK2-PW12-R00, LXK2-PW12-S00, LXK2-PW14-U00, LXK2-PW14-V00 LXK2-PM12-R00, LXK2-PM12-S00, LXK2-PM14-U00 LXK2-PE12-Q00, LXK2-PE12-R00, LXK2-PE12-S00, LXK2-PE14-T00, LXK2-PE14-U00 LXK2-PB12-K00, LXK2-PB12-L00, LXK2-PB12-M00, LXK2-PB14-N00, LXK2-PB14-P00, LXK2-PB14-Q00 LXK2-PR12-L00, LXK2-PR12-M00, LXK2-PR14-Q00, LXK2-PR14-R00 LXK2-PD12-Q00, LXK2-PD12-R00, LXK2-PD12-S00 LXK2-PH12-R00, LXK2-PH12-S00 LXK2-PL12-P00, LXK2-PL12-Q00, LXK2-PL12-R00 Source: www.luxeon.com KINGBRIGHT: KA-3528ASYC Source: www.kingbright.com
OK1 = my_parts:6N138: MOTOROLA OPTO COUPLER; MF: VISHAY/TELEFUNKEN; MPN: 6N138; OC_FARNELL: 9860150; OC_NEWARK: 35K5294
PHI PWR X Y = con-phoenix-508:MSTBA4: PHOENIX; MF: FARNELL; MPN: 1757268; OC_FARNELL: 3705195; OC_NEWARK: 71C4163
Q1 = crystal:CRYSTAL: CRYSTAL; OC_FARNELL: 1667008; OC_NEWARK: unknown
R1-R51 = rcl:R-EU_: RESISTOR, European symbol
SJ1 SJ3 SJ4 = SparkFun:SOLDERJUMPER: Solder Jumper Standard SMD solder jumper. Used to automate production. Two varients : Normally Open and Normally Closed are the same, but have different paste layers. NC will have a large amount of paste and should jumper during reflow.
SJ2 SJ5 = SparkFun:SOLDERJUMPER_2WAY: Solder Jumper 2 way solder jumper
TP1-TP27 = my_parts:TP: Test pad
USB = SparkFun:USB: USB Connectors USB-B-PTH is fully proven SKU : PRT-00139 USB-miniB is fully proven SKU : PRT-00587 USB-A-PCB is untested. USB-A-H is throughly reviewed, but untested. Spark Fun Electronics SKU : PRT-00437 USB-B-SMT is throughly reviewed, but untested. Needs silkscreen touching up. USB-A-S has not been used/tested USB-MB-H has not been used/tested
X3 X6 X8 X10 X11 = con-jst-zr:ZR4
X9 = con-jst-zr:ZR3

## Board
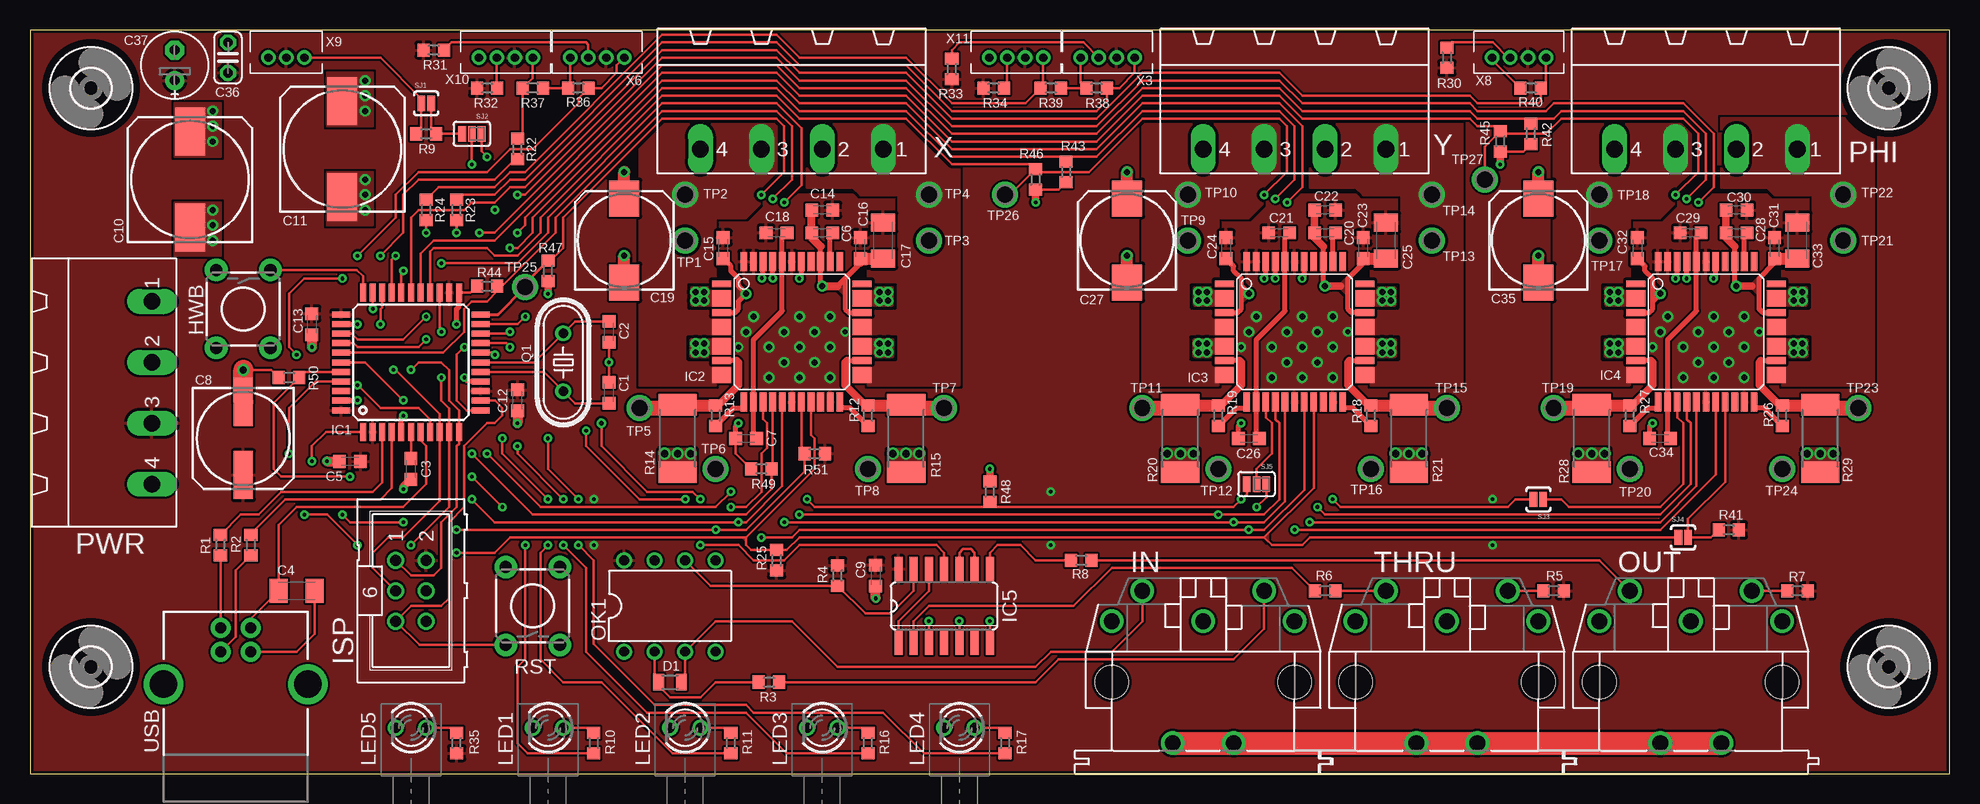
[diagram p6: board, top side]
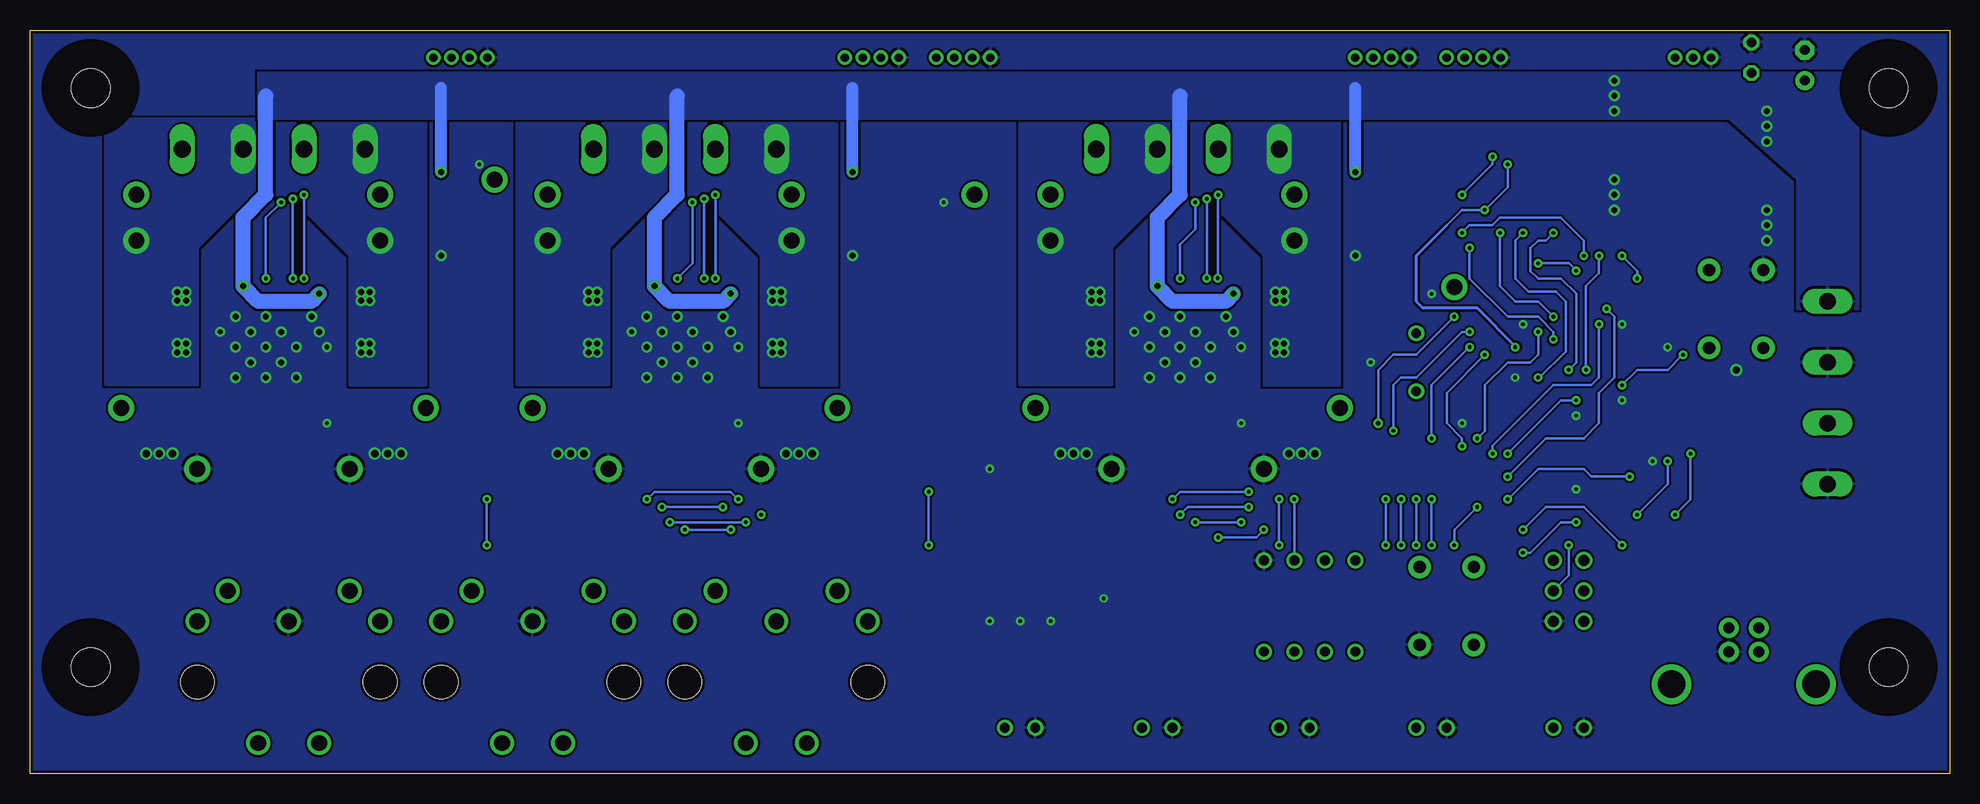
[diagram p7: board, bottom side, seen from below]

Size 160 x 62 mm. Coordinates in mm from the lower left corner, seen from the top.
Outline: 0,0 160,0 160,62 0,62 0,0
Copper layers (1*16): Top 0.035mm / dielectric 1.5mm / Bottom 0.035mm
Design rules "default *": minimum track width 0.2mm, minimum drill 0.3mm, track to track 0.18mm, track to pad 0.18mm, pad to pad 0.18mm, via to via 0.18mm, smd to smd 0mil, copper to edge 10mil, drill to drill 8mil, minimum pad ring 10mil, minimum via ring 8mil, stop-mask expansion 4mil, vias tented up to drill 0mil, thermal gap 10mil

### Footprints (pad centres in the part's own frame; a part is rotated, then mirrored left to right if it is on the bottom)
C0603K = smd 1.05 x 1.08: 1 -0.875,0; 2 0.875,0
C1206K = smd 1.5 x 2: 1 -1.5,0; 2 1.5,0
153CLV-0807 = smd 4 x 1.6: + 3.05,0; - -3.05,0
153CLV-1010 = smd 4 x 2.5: + 4,0; - -4,0
175TMP-0810 = smd 3 x 2.5: + 3.5,0; - -3.5,0
C025-024X044 = drill 0.813 octagon: 1 -1.27,0; 2 1.27,0
E2,5-6E = drill 0.813 pad 1.575 round: + -1.27,0 | drill 0.813 pad 1.575 octagon: - 1.27,0
MICROMELF-W = smd 0.9 x 1.4: A 0.95,0; C -0.95,0
3,2 = hole 3.2: 0,0
TACTILE-PTH = drill 1.016 pad 1.88 round: 1 -3.251,2.261; 2 3.251,2.261; 3 -3.251,-2.261; 4 3.251,-2.261
TQFP44 = smd 1.5 x 0.5: 1 -5.8,4; 2 -5.8,3.2; 3 -5.8,2.4; 4 -5.8,1.6; 5 -5.8,0.8; 6 -5.8,0; 7 -5.8,-0.8; 8 -5.8,-1.6; 9 -5.8,-2.4; 10 -5.8,-3.2; 11 -5.8,-4; 23 5.8,-4; 24 5.8,-3.2; 25 5.8,-2.4; 26 5.8,-1.6; 27 5.8,-0.8; 28 5.8,0; 29 5.8,0.8; 30 5.8,1.6; 31 5.8,2.4; 32 5.8,3.2; 33 5.8,4 | smd 0.5 x 1.5: 12 -4,-5.8; 13 -3.2,-5.8; 14 -2.4,-5.8; 15 -1.6,-5.8; 16 -0.8,-5.8; 17 0,-5.8; 18 0.8,-5.8; 19 1.6,-5.8; 20 2.4,-5.8; 21 3.2,-5.8; 22 4,-5.8; 34 4,5.8; 35 3.2,5.8; 36 2.4,5.8; 37 1.6,5.8; 38 0.8,5.8; 39 0,5.8; 40 -0.8,5.8; 41 -1.6,5.8; 42 -2.4,5.8; 43 -3.2,5.8; 44 -4,5.8
TRINAMIC_LQFP44 = smd 1.6 x 0.56: 1 -5.85,4; 4 -5.85,1.6; 9 -5.85,-2.4; 25 5.85,-2.4; 30 5.85,1.6; 33 5.85,4 | smd 1.6 x 1.36: 2-3 -5.85,2.8; 5-6 -5.85,0.4; 7-8 -5.85,-1.2; 10-11 -5.85,-3.6; 23-24 5.85,-3.6; 26-27 5.85,-1.2; 28-29 5.85,0.4; 31-32 5.85,2.8 | smd 0.56 x 1.6: 12 -4,-5.85; 13 -3.2,-5.85; 14 -2.4,-5.85; 15 -1.6,-5.85; 16 -0.8,-5.85; 17 0,-5.85; 18 0.8,-5.85; 19 1.6,-5.85; 20 2.4,-5.85; 21 3.2,-5.85; 22 4,-5.85; 34 4,5.85; 35 3.2,5.85; 36 2.4,5.85; 37 1.6,5.85; 38 0.8,5.85; 39 0,5.85; 40 -0.8,5.85; 41 -1.6,5.85; 42 -2.4,5.85; 43 -3.2,5.85; 44 -4,5.85
SO14 = smd 0.66 x 2.032: 1 -3.81,-3.073; 2 -2.54,-3.073; 3 -1.27,-3.073; 4 0,-3.073; 5 1.27,-3.073; 6 2.54,-3.073; 7 3.81,-3.073; 8 3.81,3.073; 9 2.54,3.073; 10 1.27,3.073; 11 0,3.073; 12 -1.27,3.073; 13 -2.54,3.073; 14 -3.81,3.073
MAB5SH = drill 1.321 round: 1 7.62,5.08; 2 0,5.08; 3 -7.62,5.08; 4 5.08,7.62; 5 -5.08,7.62; PE -2.54,-5.08; PE@ 2.54,-5.08 | hole 2.794: 7.62,0; -7.62,0
ML6 = drill 0.914 round: 1 -2.54,-1.27; 2 -2.54,1.27; 3 0,-1.27; 4 0,1.27; 5 2.54,-1.27; 6 2.54,1.27
LED_WITH_HOLDER_90_3MM = drill 0.813 round: A 0,-1.27; K 0,1.27
DIL08 = drill 0.813 round: 1 -3.81,-3.81; 2 -1.27,-3.81; 3 1.27,-3.81; 4 3.81,-3.81; 5 3.81,3.81; 6 1.27,3.81; 7 -1.27,3.81; 8 -3.81,3.81
MSTBA4 = drill 1.397 long: 1 -7.62,5.08; 2 -2.54,5.08; 3 2.54,5.08; 4 7.62,5.08
HC49/S = drill 0.813 round: 1 -2.413,0; 2 2.413,0
R0603 = smd 1 x 1.1: 1 -0.85,0; 2 0.85,0
R2512 = smd 1.8 x 3.2: 1 -2.8,0; 2 2.8,0
SJ_2S-NOTRACE = smd 0.635 x 1.27: 1 -0.401,0; 2 0.413,0
SJ_3_PASTE1&2 = smd 0.635 x 1.27: 1 -0.813,0; 2 0,0; 3 0.813,0
P1-13 = drill 1.321 pad 2.159 round: TP 0,0
USB-B-PTH = drill 0.914 pad 1.676 round: D+ 0,1.25; D- 1.981,1.25; GND 0,-1.25; VBUS 1.981,-1.25 | drill 2.286 round: S1 -2.718,-6.02; S2 -2.718,6.02
ZR-04T = drill 0.7 round: 1 0,0; 2 1.5,0; 3 3,0; 4 4.5,0
ZR-03T = drill 0.7 round: 1 0,0; 2 1.5,0; 3 3,0

### Placement (x,y rotation side)
C1  48.26,31.75 90 top
C2  48.26,36.83 270 top
C3  31.75,25.4 270 top
C4  22.23,15.24 0 top
C5  26.67,26.04 180 top
C6  66.04,45.09 0 top
C7  59.69,27.94 180 top
C8  17.78,27.94 270 top
C9  70.48,16.51 270 top
C10  13.34,49.53 90 top
C11  26.04,52.07 90 top
C12  40.64,31.11 270 top
C13  23.5,37.47 270 top
C14  66.04,46.99 0 top
C15  57.78,43.81 90 top
C16  69.22,43.81 90 top
C17  71.12,44.45 90 top
C18  62.23,45.09 180 top
C19  49.53,44.45 90 top
C20  107.95,45.09 0 top
C21  104.14,45.09 180 top
C22  107.95,46.99 0 top
C23  111.12,43.81 90 top
C24  99.69,43.81 90 top
C25  113.03,44.45 90 top
C26  101.6,27.94 180 top
C27  91.44,44.45 90 top
C28  142.24,45.09 0 top
C29  138.43,45.09 180 top
C30  142.24,46.99 0 top
C31  145.41,43.81 90 top
C32  133.99,43.81 90 top
C33  147.32,44.45 90 top
C34  135.89,27.94 180 top
C35  125.73,44.45 90 top
C36  16.51,59.69 90 top
C37  12.06,59.05 90 top
D1  53.34,7.62 0 top
H1  154.94,57.15 0 top
H2  154.94,8.89 0 top
H3  5.08,8.89 0 top
H4  5.08,57.15 0 top
HWB  17.78,38.73 270 top
IC1  31.75,34.29 90 top
IC2  63.5,36.83 0 top
IC3  105.41,36.83 0 top
IC4  139.7,36.83 0 top
IC5  76.2,13.97 0 top
IN  97.79,7.62 0 top
ISP  31.75,15.24 270 top
LED1  43.18,3.81 90 top
LED2  54.61,3.81 90 top
LED3  66.04,3.81 90 top
LED4  77.47,3.81 90 top
LED5  31.75,3.81 90 top
OK1  53.34,13.97 0 top
OUT  138.43,7.62 0 top
PHI  139.7,57.15 180 top
PWR  5.08,31.75 270 top
Q1  44.45,34.29 90 top
R1  15.88,19.05 90 top
R2  18.41,19.05 90 top
R3  61.59,7.62 180 top
R4  67.31,16.51 90 top
R5  127,15.24 0 top
R6  107.95,15.24 180 top
R7  147.32,15.24 0 top
R8  87.63,17.78 180 top
R9  33.02,53.34 0 top
R10  46.99,2.54 270 top
R11  58.42,2.54 270 top
R12  69.85,29.84 90 top
R13  57.15,29.84 90 top
R14  53.98,27.94 90 top
R15  73.03,27.94 90 top
R16  69.85,2.54 270 top
R17  81.28,2.54 270 top
R18  111.76,29.84 90 top
R19  99.06,29.84 90 top
R20  95.89,27.94 90 top
R21  114.94,27.94 90 top
R22  40.64,52.07 90 top
R23  35.56,46.99 90 top
R24  33.02,46.99 90 top
R25  62.23,17.78 90 top
R26  146.05,29.84 90 top
R27  133.35,29.84 90 top
R28  130.18,27.94 90 top
R29  149.22,27.94 90 top
R30  118.11,59.69 270 top
R31  33.66,60.33 180 top
R32  38.1,57.15 180 top
R33  76.83,58.74 270 top
R34  80.33,57.15 180 top
R35  35.56,2.54 270 top
R36  45.72,57.15 0 top
R37  41.91,57.15 180 top
R38  88.9,57.15 0 top
R39  85.09,57.15 180 top
R40  125.09,57.15 0 top
R41  141.6,20.32 0 top
R42  125.09,53.34 90 top
R43  86.36,50.16 90 top
R44  38.1,40.64 0 top
R45  122.56,52.7 90 top
R46  83.82,49.53 90 top
R47  43.18,41.91 90 top
R48  80.01,23.5 270 top
R49  60.96,25.4 0 top
R50  21.59,33.02 0 top
R51  65.41,26.67 180 top
RST  41.91,13.97 90 top
SJ1  33.02,55.88 0 top
SJ2  36.83,53.34 180 top
SJ3  125.73,22.86 180 top
SJ4  137.79,19.68 0 top
SJ5  102.23,24.13 180 top
THRU  118.11,7.62 0 top
TP1  54.61,44.45 0 top
TP2  54.61,48.26 0 top
TP3  74.93,44.45 0 top
TP4  74.93,48.26 0 top
TP5  50.8,30.48 0 top
TP6  57.15,25.4 0 top
TP7  76.2,30.48 0 top
TP8  69.85,25.4 0 top
TP9  96.52,44.45 0 top
TP10  96.52,48.26 0 top
TP11  92.71,30.48 0 top
TP12  99.06,25.4 0 top
TP13  116.84,44.45 0 top
TP14  116.84,48.26 0 top
TP15  118.11,30.48 0 top
TP16  111.76,25.4 0 top
TP17  130.81,44.45 0 top
TP18  130.81,48.26 0 top
TP19  127,30.48 0 top
TP20  133.35,25.4 0 top
TP21  151.13,44.45 0 top
TP22  151.13,48.26 0 top
TP23  152.4,30.48 0 top
TP24  146.05,25.4 0 top
TP25  41.27,40.55 0 top
TP26  81.28,48.26 0 top
TP27  121.28,49.53 0 top
USB  17.14,10.16 90 top
X  63.5,57.15 180 top
X3  92.08,59.69 180 top
X6  49.53,59.69 180 top
X8  126.36,59.69 180 top
X9  22.86,59.69 180 top
X10  41.91,59.69 180 top
X11  84.45,59.69 180 top
Y  105.41,57.15 180 top

### Tracks (layer width: path | path; a pad name or v marks a point on that pad's centre or on a via)
5VOUT_PHI
  Top 0.406: C34.1 136.5,28.2 IC4.13 136.5,36.17 138.9,38.57 IC4.40 138.9,44.68 C29.1
5VOUT_X
  Top 0.2: C7.1 60.3,28.2
  Top 0.406: 60.3,28.2 IC2.13 60.3,36.17 62.7,38.57 IC2.40 62.7,44.68 C18.1
5VOUT_Y
  Top 0.406: C26.1 102.21,28.2 IC3.13 102.21,36.17 104.61,38.57 IC3.40 104.61,44.68 C21.1
!MCU_RESET
  Top 0.2: IC1.13 38.76,31.09 39.37,30.48 39.37,29.84 38.73,29.21 38.1,29.21 36.2,27.3 36.2,22.23 34.92,20.95 34.92,14.61 34.29,13.97 31.75,13.97 ISP.5 32.46,10.72 RST.1
!MOTOR_CS  (via drill 0.3)
  Top 0.2: v60.96,19.68 63.5,19.68 64.14,20.32 v101.6,20.32 102.87,20.32 106.21,23.66 IC3.18 | v105.41,20.32 135.89,20.32 140.5,24.93 IC4.18 | v35.56,20.32 v57.15,20.32 59.69,20.32 64.56,25.18 R51.2 64.3,26.93 IC2.18 | IC1.41 23.8,32.69 21.59,30.48 v21.59,26.67 | v27.3,19.05 24.77,21.59 v22.86,21.59
  Bottom 0.2: v60.96,19.68 57.78,19.68 v57.15,20.32 | v101.6,20.32 v105.41,20.32 | v35.56,20.32 33.66,22.23 30.48,22.23 v27.3,19.05 | v22.86,21.59 21.59,22.86 v21.59,26.67
!POWER_ENABLE  (via drill 0.3)
  Top 0.2: 59.69,19.68 59.69,19.05 60.11,18.63 R25.2 63.08,18.63 64.14,19.68 102.87,19.68 | IC3.19 107.01,23.82 102.87,19.68 | 102.87,19.68 103.5,19.05 106.05,19.05 106.68,19.68 SJ4.1 | 59.69,19.68 40.01,19.68 38.73,18.41 v35.56,18.41 | v23.5,26.04 23.5,27.3 24.68,28.49 IC1.1 | v31.11,20.95 26.67,20.95 v26.04,21.59 | 59.69,19.68 65.41,25.4 65.41,27.94 65.1,28.25 IC2.19
  Bottom 0.2: v35.56,18.41 34.92,18.41 32.38,20.95 v31.11,20.95 | v26.04,21.59 23.5,24.13 v23.5,26.04
  pour Top: 59.69,19.68 59.69,19.37 59.37,19.68
  pour Top: 103.19,19.37 103.19,20 102.87,19.68
!POWER_ENABLE_PHI
  Top 0.2: R41.1 140.12,19.68 SJ4.2 138.21,21.22 141.3,24.31 IC4.19
+24V  (via drill 0.5)
  Top 0.406: IC2.4 58.75,38.43 59.05,38.73 59.05,39.37 v59.69,40.01 59.05,40.64 59.05,41.27 58.42,41.91 58.42,42.3 C15.1 | IC2.30 68.25,38.43 67.94,38.73 67.94,41.27 | 67.94,41.27 69.22,42.55 | 65.9,43.95 IC2.36 65.9,40.78 v66.04,40.64 | 67.31,40.64 67.94,41.27 | 107.81,43.95 IC3.36 107.81,40.78 v107.95,40.64 | C24.1 100.33,42.3 100.33,41.91 100.97,41.27 100.97,40.64 | 100.97,40.64 100.97,38.73 100.66,38.43 IC3.4 | 100.97,40.64 v101.6,40.01 | C23.1 111.12,42.55 109.86,41.27 109.86,38.73 110.16,38.43 IC3.30 | 142.1,43.95 IC4.36 142.1,40.78 v142.24,40.64 | C32.1 134.62,42.3 134.62,41.91 135.25,41.27 135.25,39.37 | IC4.4 134.95,38.43 135.25,38.73 135.25,39.37 | C31.1 145.41,42.55 144.15,41.27 144.15,38.73 144.45,38.43 IC4.30 | 135.25,39.37 v135.89,40.01
  Top 0.61: 69.22,42.55 C16.1 | 107.81,43.95 107.08,44.69 C20.1 C22.1 | v107.95,40.64 109.22,40.64 | 142.1,43.95 141.37,44.69 C28.1 C30.1 | v142.24,40.64 143.51,40.64
  Top 0.67: C14.1 C6.1 65.17,44.69 65.9,43.95 | v66.04,40.64 67.31,40.64
  Top 1: C16.1 C17.1 | C23.1 C25.1 | C31.1 C33.1
  Top 1.016: C27.+ v91.44,50.16 | C19.+ v49.53,50.16 | C35.+ v125.73,50.16
  Bottom 1.016: v91.44,50.16 91.44,57.15 | v49.53,50.16 49.53,57.15 | v125.73,50.16 125.73,57.15
  Bottom 1.27: 64.14,56.52 64.14,48.26 66.04,46.35 v66.04,40.64 64.77,39.37 60.33,39.37 v59.69,40.01 | 106.05,56.52 106.05,48.26 107.95,46.35 v107.95,40.64 106.68,39.37 102.23,39.37 v101.6,40.01 | 140.34,56.51 140.34,48.26 142.24,46.35 v142.24,40.64 140.97,39.37 136.53,39.37 v135.89,40.01
  other vias: 15.24,55.24 15.24,53.98 15.24,52.7 27.94,57.78 27.94,56.52 27.94,55.24
  pour Top: 67.31,40.64 67.94,40.01 67.94,41.27
  pour Top: 59.69,40.01 59.05,40.64 59.05,39.37
  pour Bottom (rank 2): 7.62,58.42 140.97,58.42 140.97,54.61 127,54.61 124.46,54.61 92.71,54.61 90.17,54.61 50.8,54.61 48.26,54.61 18.41,54.61 12.7,49.53 12.7,38.73 7.62,38.73
  pour Top (rank 2, no thermals): 12.06,55.88 15.88,55.88 15.88,51.44 12.06,51.44
  pour Top (rank 2, no thermals): 24.77,58.42 28.57,58.42 28.57,53.98 24.77,53.98
  pour Top: 101.6,40.01 100.97,40.64 100.97,39.37
  pour Top: 109.86,41.27 109.22,40.64 109.86,40.01
  pour Top: 144.15,41.27 143.51,40.64 144.15,40.01
  pour Top: 135.25,40.64 135.89,40.01 135.25,39.37
A1_PHI  (via drill 0.5)
  other vias: 131.68,40.14 132.4,40.14 131.68,39.42 132.4,39.42 131.68,35.84 132.4,35.84 131.68,35.12 132.4,35.12
  pour Top (isolate 0.254, no thermals): 133.35,39.07 133.35,40.49 131.33,40.49 131.33,39.07
  pour Top (isolate 0.254, no thermals): 133.35,36.2 133.35,34.74 131.32,34.74 131.32,36.2
  pour Bottom (rank 4, no thermals): 133.35,32.38 127,32.38 127,54.61 139.7,54.61 139.7,48.26 138.43,48.26 133.35,43.18
A1_X  (via drill 0.5)
  other vias: 55.48,40.14 56.2,40.14 55.48,39.42 56.2,39.42 55.48,35.84 56.2,35.84 55.48,35.12 56.2,35.12
  pour Top (isolate 0.254, no thermals): 57.15,36.2 57.15,34.74 55.12,34.74 55.12,36.2
  pour Top (isolate 0.254, no thermals): 57.15,39.07 57.15,40.49 55.13,40.49 55.13,39.07
  pour Bottom (rank 4, no thermals): 57.15,32.38 50.8,32.38 50.8,54.61 63.5,54.61 63.5,48.26 62.23,48.26 57.15,43.18
A1_Y  (via drill 0.5)
  other vias: 97.39,40.14 98.11,40.14 97.39,39.42 98.11,39.42 97.39,35.84 98.11,35.84 97.39,35.12 98.11,35.12
  pour Top (isolate 0.254, no thermals): 99.06,39.07 99.06,40.49 97.04,40.49 97.04,39.07
  pour Top (isolate 0.254, no thermals): 99.06,36.2 99.06,34.74 97.03,34.74 97.03,36.2
  pour Bottom (rank 4, no thermals): 99.06,32.38 92.71,32.38 92.71,54.61 105.41,54.61 105.41,48.26 104.14,48.26 99.06,43.18
A2_PHI
  pour Top (isolate 0.254, rank 4, no thermals): 133.35,32.38 133.35,46.35 135.89,46.35 138.43,48.9 138.43,54.61 127,54.61 127,32.38
A2_X
  pour Top (isolate 0.254, rank 4, no thermals): 57.15,32.38 57.15,46.35 59.69,46.35 62.23,48.9 62.23,54.61 50.8,54.61 50.8,32.38
A2_Y
  pour Top (isolate 0.254, rank 4, no thermals): 99.06,32.38 99.06,46.35 101.6,46.35 104.14,48.9 104.14,54.61 92.71,54.61 92.71,32.38
B1_PHI  (via drill 0.5)
  other vias: 147,40.14 147.72,40.14 147,39.42 147.72,39.42 147,35.84 147.72,35.84 147,35.12 147.72,35.12
  pour Top (isolate 0.254, no thermals): 146.05,40.49 146.05,39.07 148.1,39.07 148.1,40.49
  pour Top (isolate 0.254, no thermals): 146.05,34.74 146.05,36.2 148.1,36.2 148.1,34.74
  pour Bottom (rank 4, no thermals): 146.05,32.38 153.67,32.38 153.67,54.61 140.97,54.61 140.97,48.9 146.05,43.81
B1_X  (via drill 0.5)
  other vias: 70.8,35.84 71.52,35.84 70.8,35.12 71.52,35.12 70.8,40.14 71.52,40.14 70.8,39.42 71.52,39.42
  pour Top (isolate 0.254, no thermals): 69.85,34.74 69.85,36.2 71.9,36.2 71.9,34.74
  pour Top (isolate 0.254, no thermals): 69.85,40.49 69.85,39.07 71.9,39.07 71.9,40.49
  pour Bottom (rank 4, no thermals): 69.85,32.38 77.47,32.38 77.47,54.61 64.77,54.61 64.77,48.9 69.85,43.81
B1_Y  (via drill 0.5)
  other vias: 112.71,40.14 113.43,40.14 112.71,39.42 113.43,39.42 112.71,35.84 113.43,35.84 112.71,35.12 113.43,35.12
  pour Top (isolate 0.254, no thermals): 111.76,40.49 111.76,39.07 113.81,39.07 113.81,40.49
  pour Top (isolate 0.254, no thermals): 111.76,34.74 111.76,36.2 113.81,36.2 113.81,34.74
  pour Bottom (rank 4, no thermals): 111.76,32.38 119.38,32.38 119.38,54.61 106.68,54.61 106.68,48.9 111.76,43.81
B2_PHI
  pour Top (isolate 0.254, rank 4, no thermals): 146.05,32.38 153.67,32.38 153.67,54.61 140.97,54.61 140.97,48.9 144.78,48.9 145.41,48.26 148.59,48.26 148.59,41.91 146.05,41.91
B2_X
  pour Top (isolate 0.254, rank 4, no thermals): 69.85,32.38 77.47,32.38 77.47,54.61 64.77,54.61 64.77,48.9 68.58,48.9 69.22,48.26 72.39,48.26 72.39,41.91 69.85,41.91
B2_Y
  pour Top (isolate 0.254, rank 4, no thermals): 111.76,32.38 119.38,32.38 119.38,54.61 106.68,54.61 106.68,48.9 110.49,48.9 111.12,48.26 114.3,48.26 114.3,41.91 111.76,41.91
BRA_X
  Top 0.406: 58.91,34.43 IC2.9
  Top 0.61: 58.91,34.43 59.05,34.29 59.05,32.38 57.37,30.7 R13.2 | R14.2 53.98,30.7
  Top 1: 53.98,30.7 R13.2
  Top 1.27: TP5.TP 53.98,30.48 R14.2
BRB_X
  Top 0.406: 68.08,34.43 IC2.25
  Top 0.61: 68.08,34.43 67.94,34.29 67.94,32.38 69.64,30.7 R12.2
  Top 0.67: 73.03,30.7 R15.2
  Top 1: R12.2 73.03,30.7
  Top 1.27: TP7.TP 73.03,30.48 R15.2
GND  (via drill 0.3, 0.4, 0.5, 0.6)
  Top 0.2: C4.2 23.73,11.66 22.23,10.16 USB.GND | C2.2 v48.26,34.29 C1.2 | R40.1 121.86,59.53 X8.4 | X3.4 87.58,57.62 R38.1 R39.1 | X6.4 45.03,57.31 R36.1 R37.1 | IC5.3 v74.93,12.7 | IC5.5 v77.47,12.7 | IC5.7 v80.01,12.7 | R43.1 85.72,48.68 R46.1 | R42.1 124.46,51.85 R45.1 | R44.1 36.7,40.09 IC1.23 | R50.1 20.11,33.66 v17.78,33.66 | R49.1 58.81,26.7 C7.2
  Top 0.406: IC1.35 27.28,37.49 v27.3,37.47 | IC1.43 27.28,31.09 v27.3,31.11 | IC1.5 30.95,29.68 v31.11,29.84 | IC1.15 36.52,32.69 v36.2,33.02 | C7.2 58.81,28.97 v59.05,29.21 | IC1.23 35.75,38.92 35.56,38.73 v35.56,37.47 | C26.2 100.72,28.97 v100.97,29.21 | C34.2 135.01,28.97 v135.25,29.21
  Top 0.61: R45.1 v122.56,50.8 | v83.82,47.62 R46.1 | v43.18,40.01 R47.1 | R48.1 v80.01,25.4
  Top 0.67: v31.11,23.7 31.11,23.89 C3.2
  Top 0.813: v24.77,26.04 C5.2 | v70.48,14.61 C9.2 | C12.2 v40.64,29.21 | C13.2 v23.5,35.56
  Top 1.016: C27.- v91.44,43.18 | C19.- v49.53,43.18 | C35.- v125.73,43.18
  Top 1.676: C8.- v17.78,33.66
  other vias: 52.88,26.67 53.98,26.67 55.06,26.67 71.92,26.67 73.03,26.67 74.11,26.67 94.78,26.67 95.89,26.67 96.97,26.67 113.83,26.67 114.94,26.67 116.03,26.67 129.07,26.67 130.18,26.67 131.25,26.67 148.12,26.67 149.22,26.67 150.31,26.67 61.59,33.02 64.14,33.02 66.67,33.02 61.59,35.56 64.14,35.56 66.67,35.56 59.05,35.56 60.33,38.1 64.14,38.1 66.67,38.1 15.24,46.99 15.24,45.72 15.24,44.45 27.94,49.53 27.94,48.26 27.94,46.99 62.87,36.83 65.41,36.83 62.87,34.29 65.41,34.29 106.05,38.1 108.58,38.1 104.78,36.83 107.31,36.83 103.5,35.56 106.05,35.56 108.58,35.56 104.78,34.29 107.31,34.29 103.5,33.02 106.05,33.02 108.58,33.02 102.23,38.1 100.97,35.56 137.79,33.02 139.06,34.29 140.34,33.02 141.6,34.29 142.88,33.02 135.25,35.56 136.53,38.1 137.79,35.56 140.34,35.56 142.88,35.56 139.06,36.83 141.6,36.83 144.15,36.83 109.86,36.83 140.34,38.1 142.88,38.1 67.94,36.83 59.69,36.83 101.6,36.83 135.89,36.83
  pour Bottom (rank 6): -2.54,64.77 162.56,64.77 162.56,-2.54 -2.54,-2.54
  pour Top (no thermals): 52.7,26.04 52.7,26.85 55.24,26.85 55.24,26.04
  pour Top (no thermals): 71.75,25.4 71.75,26.85 74.3,26.85 74.3,25.4
  pour Top (no thermals): 94.61,25.4 94.61,26.85 97.16,26.85 97.16,25.4
  pour Top (no thermals): 113.67,25.4 116.2,25.4 116.2,26.85 113.67,26.85
  pour Top (no thermals): 128.91,25.4 131.44,25.4 131.44,26.85 128.91,26.85
  pour Top (no thermals): 147.96,25.4 150.5,25.4 150.5,26.85 147.96,26.85
  pour Top (rank 5): 57.15,30.48 57.15,48.26 72.39,48.26 72.39,30.48
  pour Top (rank 5): 99.06,30.48 99.06,48.26 114.3,48.26 114.3,30.48
  pour Top (rank 2, no thermals): 12.06,47.62 15.88,47.62 15.88,43.18 12.06,43.18
  pour Top (rank 2, no thermals): 24.77,50.16 28.57,50.16 28.57,45.72 24.77,45.72
  pour Top (rank 5): 133.35,30.48 133.35,48.26 148.59,48.26 148.59,30.48
HWB
  Top 0.2: IC1.33 27.75,41.47 27.23,41.99 HWB.1
ISP_MISO  (via drill 0.3)
  Top 0.2: ISP.1 31.75,16.51 33.66,16.51 34.29,17.14 34.29,20.95 35.56,22.23 35.56,27.3 35.75,27.5 IC1.11 35.75,30.29 34.92,31.11 34.92,33.66 34.29,34.29 32.38,34.29 v31.75,33.66 | v33.02,45.09 R24.1
  Bottom 0.2: v33.02,45.09 33.66,44.45 34.29,44.45 34.92,43.81 34.92,41.91 34.29,41.27 32.38,41.27 31.11,40.01 31.11,34.29 v31.75,33.66
ISP_MOSI  (via drill 0.3)
  Top 0.2: v35.56,45.09 R23.1 | v34.29,33.02 34.29,31.11 34.95,30.45 IC1.10 34.95,22.25 v31.75,19.05
  Bottom 0.2: v35.56,45.09 36.2,44.45 36.2,41.27 35.12,40.2 32.83,40.2 32,39.37 32,35.2 34.18,33.02 v34.29,33.02 | v31.75,19.05 31.75,16.51 ISP.4
ISP_SCLK  (via drill 0.3)
  Top 0.2: ISP.3 28.57,17.14 28.57,18.41 29.84,19.68 31.11,19.68 34.15,22.72 IC1.9 34.15,29.98 30.48,33.66 v30.3,33.66 | v29.21,43.18 31.11,45.09 31.11,48.26 32.38,49.53 38.73,49.53 40.64,51.44 R22.1
  Bottom 0.2: v30.3,33.66 30.3,40.64 29.21,41.73 v29.21,43.18
LED1  (via drill 0.3)
  Top 0.2: IC1.32 28.55,38.76 v28.57,38.73 | v39.37,22.23 v36.83,24.77 | v41.27,19.05 41.27,9.53 40.64,8.89 40.64,2.54 41.49,1.69 R10.2
  Bottom 0.2: v28.57,38.73 27.94,38.1 27.94,33.02 29.21,31.75 29.21,29.21 30.48,27.94 33.66,27.94 v36.83,24.77 | v41.27,19.05 41.27,20.32 v39.37,22.23
LED2  (via drill 0.3)
  Top 0.2: IC1.25 34.15,36.97 v34.29,36.83 | v43.18,22.86 39.37,26.67 v39.37,27.94 | v43.18,19.05 42.55,18.41 42.55,9.53 44.45,7.62 47.62,7.62 53.55,1.69 R11.2
  Bottom 0.2: v34.29,36.83 34.29,34.92 34.92,34.29 36.83,34.29 38.73,32.38 38.73,28.57 v39.37,27.94 | v43.18,19.05 v43.18,22.86
LED3  (via drill 0.3)
  Top 0.2: IC1.18 38.57,35.09 v38.73,34.92 | v44.45,22.86 40.64,26.67 v40.64,27.3 | v44.45,19.05 46.35,17.14 46.35,10.16 51.44,5.08 59.69,5.08 63.08,1.69 R16.2
  Bottom 0.2: v38.73,34.92 41.91,31.75 41.91,29.21 40.64,27.94 v40.64,27.3 | v44.45,19.05 v44.45,22.86
LED4  (via drill 0.3)
  Top 0.2: IC1.19 39.67,35.89 v40.01,35.56 | v43.18,27.94 43.18,25.4 v45.72,22.86 | v45.72,19.05 46.99,17.78 46.99,10.79 52.07,5.71 59.69,5.71 60.33,5.08 71.12,5.08 74.51,1.69 R17.2
  Bottom 0.2: v43.18,27.94 43.18,32.38 v40.01,35.56 | v45.72,19.05 v45.72,22.86
MIDI_IN  (via drill 0.3)
  Top 0.2: IC1.20 39.87,36.69 v40.01,36.83 | v46.35,28.57 46.35,27.3 50.8,22.86 v54.61,22.86 | OK1.6 56.73,15.66 R4.1 69.64,13.34 71.75,13.34 73.66,15.24 IC5.13
  Bottom 0.2: v40.01,36.83 40.64,36.83 44.45,33.02 45.72,33.02 46.35,32.38 v46.35,28.57 | OK1.6 v54.61,22.86
MIDI_OUT  (via drill 0.3, 0.4)
  Top 0.2: v41.27,38.1 40.66,37.49 IC1.21 | v47.62,29.21 47.62,27.3 51.44,23.5 55.24,23.5 v55.88,22.86 | v55.88,19.05 59.05,19.05 60.33,17.78 62.87,17.78 64.14,19.05 75.56,19.05 76.2,18.41 IC5.11
  Bottom 0.2: v41.27,38.1 44.45,34.92 46.35,34.92 47.62,33.66 v47.62,29.21 | v55.88,22.86 v55.88,19.05
MOTOR_DAISY_X_Y  (via drill 0.3)
  Top 0.2: IC2.14 61.1,29.56 61.45,29.21 61.45,27.16 60.96,26.67 60.96,23.5 59.69,22.23 v58.42,22.23 | v64.14,21.59 v99.06,21.59 102.87,21.59 104.14,22.86 104.14,29.21 103.81,29.54 IC3.15
  Bottom 0.2: v58.42,22.23 63.5,22.23 v64.14,21.59
MOTOR_DAISY_Y_PHI  (via drill 0.3)
  Top 0.2: v107.31,22.23 107.95,21.59 135.89,21.59 138.43,24.13 138.43,29.21 138.1,29.54 IC4.15 | v102.23,22.23 103.05,23.04 SJ5.1
  Bottom 0.2: v102.23,22.23 v107.31,22.23
MOTOR_MISO  (via drill 0.3)
  Top 0.2: IC1.31 29.35,38.88 29.21,38.73 v29.21,37.47 | v38.1,26.67 42.55,22.23 57.15,22.23 v58.42,23.5 | v64.77,22.86 65.41,22.23 79.59,22.23 R48.2 80.43,22.23 100.33,22.23 v100.97,22.86 101.42,23.32 SJ5.3 | v108.58,22.86 109.22,22.23 123.19,22.23 123.83,22.86 SJ3.2
  Bottom 0.2: v29.21,37.47 29.21,33.02 29.84,32.38 33.02,32.38 38.1,27.3 v38.1,26.67 | v58.42,23.5 64.14,23.5 v64.77,22.86 | v100.97,22.86 101.6,23.5 107.95,23.5 v108.58,22.86
MOTOR_MOSI  (via drill 0.3)
  Top 0.2: v36.83,26.67 41.91,21.59 59.69,21.59 61.81,23.71 R49.2 61.9,25.49 IC2.15 | v31.11,31.11 27.94,34.29 IC1.39
  Bottom 0.2: v36.83,26.67 32.38,31.11 v31.11,31.11
MOTOR_SCK  (via drill 0.3)
  Top 0.2: IC2.16 62.7,23.96 59.69,20.95 v59.05,20.95 38.73,20.95 v36.83,22.86 | v62.87,20.95 v100.33,20.95 102.87,20.95 104.61,22.7 IC3.16 | v106.68,20.95 135.89,20.95 138.9,23.96 IC4.16 | v26.67,24.77 20.95,24.77 20.32,25.4 20.32,30.9 R50.2 22.91,33.49 IC1.40
  Bottom 0.2: v59.05,20.95 v62.87,20.95 | v100.33,20.95 v106.68,20.95 | v26.67,24.77 29.84,24.77 30.48,25.4 34.29,25.4 v36.83,22.86
N$1
  Top 0.2: IC1.3 29.35,24.27 28.57,23.5 20.95,23.5 19.05,21.59 17.57,21.59 R1.2
N$2
  Top 0.2: IC1.4 30.15,23.8 29.21,22.86 21.27,22.86 18.41,20 R2.2
N$3
  Top 0.2: IC1.16 42.84,33.49 Q1.1 45.45,30.88 C1.1
N$4
  Top 0.2: IC1.17 42.04,34.29 Q1.2 45.45,37.7 C2.1
N$5
  Top 0.2: R3.1 83.82,7.62 85.72,9.53 100.33,9.53 102.87,12.06 IN.4
N$6
  Top 0.2: R3.2 57.15,7.62 55.88,6.35 53.34,6.35 52.39,7.3 D1.C 52.07,7.94 OK1.2
N$7
  Top 0.2: D1.A 54.61,7.94 OK1.3 57.15,12.7 63.5,12.7 67.31,8.89 83.82,8.89 85.09,10.16 90.17,10.16 92.71,12.7 IN.5
N$8
  Top 0.2: USB.D+ 17.14,11.41 17.14,16.93 R2.1
N$9
  Top 0.2: IC5.12 74.93,15.24 72.39,12.7 IC5.1
N$10
  Top 0.2: IC5.2 73.66,12.7 74.93,13.97 87,13.97 90.17,17.14 105.19,17.14 R6.2
N$11
  Top 0.2: R6.1 THRU.5
N$12
  Top 0.2: THRU.4 R5.1
N$13
  Top 0.2: IC5.10 77.47,18.41 77.79,18.73 78.42,18.73 78.74,18.41 IC5.9
N$14
  Top 0.2: IC5.8 80.01,18.41 80.64,19.05 82.55,19.05 83.82,17.78 R8.2
N$15
  Top 0.2: R8.1 130.81,17.78 OUT.5
N$16
  Top 0.2: OUT.4 R7.1
N$17
  Top 0.2: 15.88,12.16 R1.1
  Top 0.254: USB.D- 15.88,12.16
N$18
  Top 0.2: 32.51,53.68 R9.1 32.62,53.79 SJ1.1 32.62,56.28 29.21,59.69 X9.1
N$19
  Top 0.2: R30.1 118.53,60.96 121.92,60.96 123.19,59.69 X8.3
N$20
  Top 0.2: X6.3 46.53,60.78 46.35,60.96 35.14,60.96 R31.1
N$23
  Top 0.2: X10.3 38.91,57.19 R32.1
N$24
  Top 0.2: X3.3 87.81,60.96 77.47,60.96 76.83,60.33 R33.1
N$25
  Top 0.2: X11.3 81.45,57.43 R34.1
N$26
  Top 0.2: LED5.A 35.14,3.81 R35.1
N$27
  Top 0.406: C6.2 66.7,44.87 IC2.35
N$28
  Top 0.2: R10.1 46.57,3.81 LED1.A
N$29
  Top 0.2: R11.1 58,3.81 LED2.A
N$32
  Top 0.2: R16.1 69.43,3.81 LED3.A
N$33
  Top 0.2: R17.1 80.86,3.81 LED4.A
N$34
  Top 0.406: R13.1 58.63,30.48 59.5,30.48 IC2.12
N$36
  Top 0.406: R12.1 68.36,30.48 67.5,30.48 IC2.22
N$38
  Top 0.406: IC4.12 135.7,30.48 134.84,30.48 R27.1
N$39
  Top 0.406: 135.12,34.43 IC4.9
  Top 0.61: 135.12,34.43 135.25,34.29 135.25,32.38 133.56,30.7 R27.2
  Top 1: R27.2 130.22,30.7 R28.2
  Top 1.27: R28.2 129.91,30.48 TP19.TP
N$43
  Top 0.406: IC3.12 101.41,30.48 100.55,30.48 R19.1
N$44
  Top 0.406: 100.83,34.43 IC3.9 | R19.2 99.28,30.7
  Top 0.61: 100.83,34.43 100.97,34.29 100.97,32.38 99.28,30.7
  Top 1: R19.2 95.93,30.7 R20.2
  Top 1.27: R20.2 95.62,30.48 TP11.TP
N$45
  Top 0.406: IC3.22 109.41,30.48 110.28,30.48 R18.1
N$46
  Top 0.406: 110,34.43 IC3.25 | 111.55,30.7 R18.2
  Top 0.61: 110,34.43 109.86,34.29 109.86,32.38 111.55,30.7
  Top 1: R18.2 114.89,30.7 R21.2
  Top 1.27: R21.2 115.19,30.48 TP15.TP
N$47
  Top 0.406: IC3.35 108.61,44.87 C20.2
N$48
  Top 0.406: IC4.22 143.7,30.48 144.56,30.48 R26.1
N$49
  Top 0.406: 144.28,34.43 IC4.25
  Top 0.61: 144.28,34.43 144.15,34.29 144.15,32.38 145.84,30.7 R26.2
  Top 1: R26.2 149.18,30.7 R29.2
  Top 1.27: R29.2 149.49,30.48 TP23.TP
N$50
  Top 0.406: IC4.35 142.9,44.87 C28.2
PE
  Top 1.93: IN.PE IN.PE@ THRU.PE THRU.PE@ OUT.PE OUT.PE@
PHI_DIR  (via drill 0.3)
  Top 0.2: v37.47,45.09 38.73,45.09 52.7,59.05 62.23,59.05 64.14,57.15 73.03,57.15 76.83,53.34 88.9,53.34 92.71,57.15 104.14,57.15 106.05,55.24 120.02,55.24 120.65,54.61 124.67,54.61 R42.2 125.52,54.61 127,54.61 127.64,55.24 137.79,55.24 139.7,53.34 139.7,49.53 v138.1,47.93 | IC1.36 26.81,36.69 27.3,36.2 31.11,36.2 v33.02,38.1
  Top 0.406: v138.1,41.27 IC4.41
  Bottom 0.2: v33.02,38.1 34.29,39.37 36.2,39.37 37.47,40.64 v37.47,45.09 | v138.1,47.93 v138.1,41.27
PHI_REF
  Top 0.2: IC1.28 31.75,46.35 32.38,46.99 36.2,46.99 36.83,47.62 38.73,47.62 40.01,48.9 41.27,48.9 52.7,60.33 62.23,60.33 64.14,58.42 73.03,58.42 76.83,54.61 88.9,54.61 92.71,58.42 104.14,58.42 106.05,56.52 120.02,56.52 120.65,55.88 125.73,55.88 125.94,56.09 R40.2 126.36,57.57 X8.1
PHI_SERVO
  Top 0.2: R9.2 33.53,53.68 | R9.2 SJ2.3 | SJ1.2 33.43,53.78 R9.2
PHI_STALL  (via drill 0.3)
  Top 0.2: SJ2.1 37.64,51.89 v38.1,51.44 | v40.64,48.26 41.27,48.26 52.7,59.69 62.23,59.69 64.14,57.78 73.03,57.78 76.83,53.98 88.9,53.98 92.71,57.78 104.14,57.78 106.05,55.88 120.02,55.88 120.65,55.24 126.36,55.24 127,55.88 137.79,55.88 140.34,53.34 140.34,48.9 v139.06,47.62
  Top 0.406: IC4.38 140.5,41.44 v140.34,41.27
  Bottom 0.2: v38.1,51.44 38.1,50.8 v40.64,48.26 | v140.34,41.27 140.34,46.35 v139.06,47.62
PHI_STALL/PHI_SERVO  (via drill 0.3)
  Top 0.2: v36.2,35.56 35.56,34.92 35.56,31.11 36.38,30.29 IC1.12 | v36.83,50.8 SJ2.2
  Bottom 0.2: 41.91,45.72 40.64,46.99 v38.73,46.99 36.83,48.9 v36.83,50.8
  Bottom 0.254: 41.91,45.72 44.45,43.18 44.45,39.37 43.88,38.8 39.37,38.8 36.2,35.62 v36.2,35.56
PHI_STEP  (via drill 0.3)
  Top 0.2: IC1.27 32.55,43.34 33.66,44.45 38.73,44.45 52.7,58.42 62.23,58.42 64.14,56.52 73.03,56.52 76.83,52.7 88.9,52.7 92.71,56.52 104.14,56.52 106.05,54.61 120.02,54.61 120.65,53.98 122.14,53.98 R45.2 | v137.16,48.26 139.06,50.16 139.06,53.34 137.79,54.61 127.64,54.61 126.36,53.34 122.77,53.34 R45.2 | TP27.TP 121.28,52.28 R45.2
  Top 0.406: IC4.42 137.3,41.41 v137.16,41.27
  Bottom 0.2: v137.16,48.26 v137.16,41.27
SDO_PHI
  Top 0.2: SJ3.1 127.64,22.86 128.27,22.23 135.89,22.23 137.79,24.13 137.79,29.21 137.3,29.7 IC4.14
SDO_Y
  Top 0.2: IC3.14 103.01,29.7 103.5,29.21 103.5,26.67 102.23,25.4 SJ5.2
UCAP
  Top 0.2: C3.1 IC1.6
VBUS
  Top 0.2: USB.VBUS 18.39,12.91 C4.1 20.73,20.73 22.23,22.23 31.11,22.23 33.02,24.13 33.02,27.3 32.55,27.77 IC1.7
VCC  (via drill 0.3)
  Bottom 0.2: v85.09,19.05 v85.09,23.5 | v46.99,19.05 v46.99,22.86 | v121.92,19.05 v121.92,22.86
  pour Top (rank 6): -5.08,67.31 165.1,67.31 165.1,-5.08 -5.08,-5.08
X_DIR  (via drill 0.3)
  Top 0.2: v61.9,47.93 63.5,49.53 63.5,53.98 62.23,55.24 52.7,55.24 43.81,46.35 43.81,45.09 39.37,40.64 R44.2 38.95,40.22 38.1,39.37 36.83,39.37 36.2,38.73 36.2,36.83 34.45,35.09 IC1.38
  Top 0.406: v61.9,41.31 IC2.41
  Bottom 0.2: v61.9,47.93 v61.9,41.31
X_REF_END
  Top 0.2: X10.1 41.91,58 R37.2 41.06,53.34 R22.2
X_REF_START  (via drill 0.3)
  Top 0.2: v27.3,32.38 29.21,30.48 32.38,30.48 33.35,29.52 IC1.8 | X6.1 48.9,59.05 48.9,58.42 47.62,57.15 R36.2 45.72,56.3 45.72,55.88 41.91,52.07 40.01,52.07 38.1,50.16 32.38,50.16 30.48,48.26 30.48,46.35 v27.3,43.18 | v26.04,41.27 22.86,41.27 21.59,40.01 21.59,35.56 v22.23,34.92
  Bottom 0.2: v27.3,32.38 26.04,33.66 23.5,33.66 v22.23,34.92 | v27.3,43.18 26.04,41.91 v26.04,41.27
X_STALL  (via drill 0.3)
  Top 0.2: v34.29,42.55 40.64,42.55 43.18,45.09 43.18,46.35 52.7,55.88 62.23,55.88 64.3,53.81 64.3,49.06 v62.87,47.62 | v31.11,41.91 30.95,41.74 IC1.29
  Top 0.406: IC2.38 64.3,41.44 v64.14,41.27
  Bottom 0.2: v62.87,47.62 62.87,45.38 64.14,44.12 v64.14,41.27 | v31.11,41.91 31.75,42.55 v34.29,42.55
X_STEP  (via drill 0.3)
  Top 0.2: v60.96,48.26 62.87,50.16 62.87,53.98 62.23,54.61 52.7,54.61 44.45,46.35 44.45,43.81 43.4,42.76 R47.2
  Top 0.254: R47.2 41.27,40.85 TP25.TP 39.02,38.29 IC1.22
  Top 0.406: IC2.42 61.1,41.41 v61,41.31
  Bottom 0.2: v60.96,48.26 61,48.22 v61,41.31
Y_DIR  (via drill 0.3)
  Top 0.2: v40.01,43.81 40.64,43.81 41.91,45.09 41.91,46.35 52.7,57.15 62.23,57.15 64.14,55.24 73.03,55.24 76.83,51.44 85.94,51.44 R43.2 86.78,51.44 88.9,51.44 92.71,55.24 104.14,55.24 105.41,53.98 105.41,49.53 v103.81,47.93 | v33.02,36.2 32.38,35.56 27.3,35.56 26.98,35.89 IC1.37
  Top 0.406: v103.81,41.27 IC3.41
  Bottom 0.2: v40.01,43.81 40.01,41.27 36.83,38.1 34.29,38.1 33.02,36.83 v33.02,36.2 | v103.81,47.93 v103.81,41.27
Y_REF_END
  Top 0.2: R24.2 34.08,48.9 38.73,48.9 40.01,50.16 41.27,50.16 52.7,61.59 62.23,61.59 64.14,59.69 73.03,59.69 76.83,55.88 82.97,55.88 R39.2 84.45,57.37 X11.1
Y_REF_START
  Top 0.2: X3.1 92.08,58.42 90.81,57.15 R38.2 89.75,56.09 88.9,55.24 76.83,55.24 73.03,59.05 64.14,59.05 62.23,60.96 52.7,60.96 41.27,49.53 40.01,49.53 38.73,48.26 35.98,48.26 R23.2
Y_STALL  (via drill 0.3)
  Top 0.2: v40.64,45.09 41.27,45.72 41.27,46.35 52.7,57.78 62.23,57.78 64.14,55.88 73.03,55.88 76.83,52.07 88.9,52.07 92.71,55.88 104.14,55.88 106.05,53.98 106.05,48.9 v104.78,47.62 | v30.48,43.18 30.15,42.85 IC1.30
  Top 0.406: IC3.38 106.21,41.44 v106.05,41.27
  Bottom 0.2: v40.64,45.09 40.01,45.72 38.1,45.72 37.47,46.35 32.38,46.35 30.48,44.45 v30.48,43.18 | v106.05,41.27 104.78,42.55 v104.78,47.62
Y_STEP  (via drill 0.3)
  Top 0.2: IC1.26 33.35,43.51 33.66,43.81 38.1,43.81 38.73,43.18 40.64,43.18 42.55,45.09 42.55,46.35 52.7,56.52 62.23,56.52 64.14,54.61 73.03,54.61 76.83,50.8 83.4,50.8 R46.2 | v102.87,48.26 104.78,50.16 104.78,53.98 104.14,54.61 92.71,54.61 88.27,50.16 84.03,50.16 R46.2 | R46.2 81.7,48.26 TP26.TP
  Top 0.4: IC3.42 103.01,41.41 v102.87,41.27
  Bottom 0.2: v102.87,48.26 v102.87,41.27